# EasyEDA Pro project wave filter_test.eprj

# Schematic Schematic1
Create Date: 2023-06-25; Page Name: P1; Project Name: wave filter_test; Schematic Name: Schematic1; Update Date: 2023-07-01; Company: 嘉立创EDA; Page Size: A3; Version: V1.0
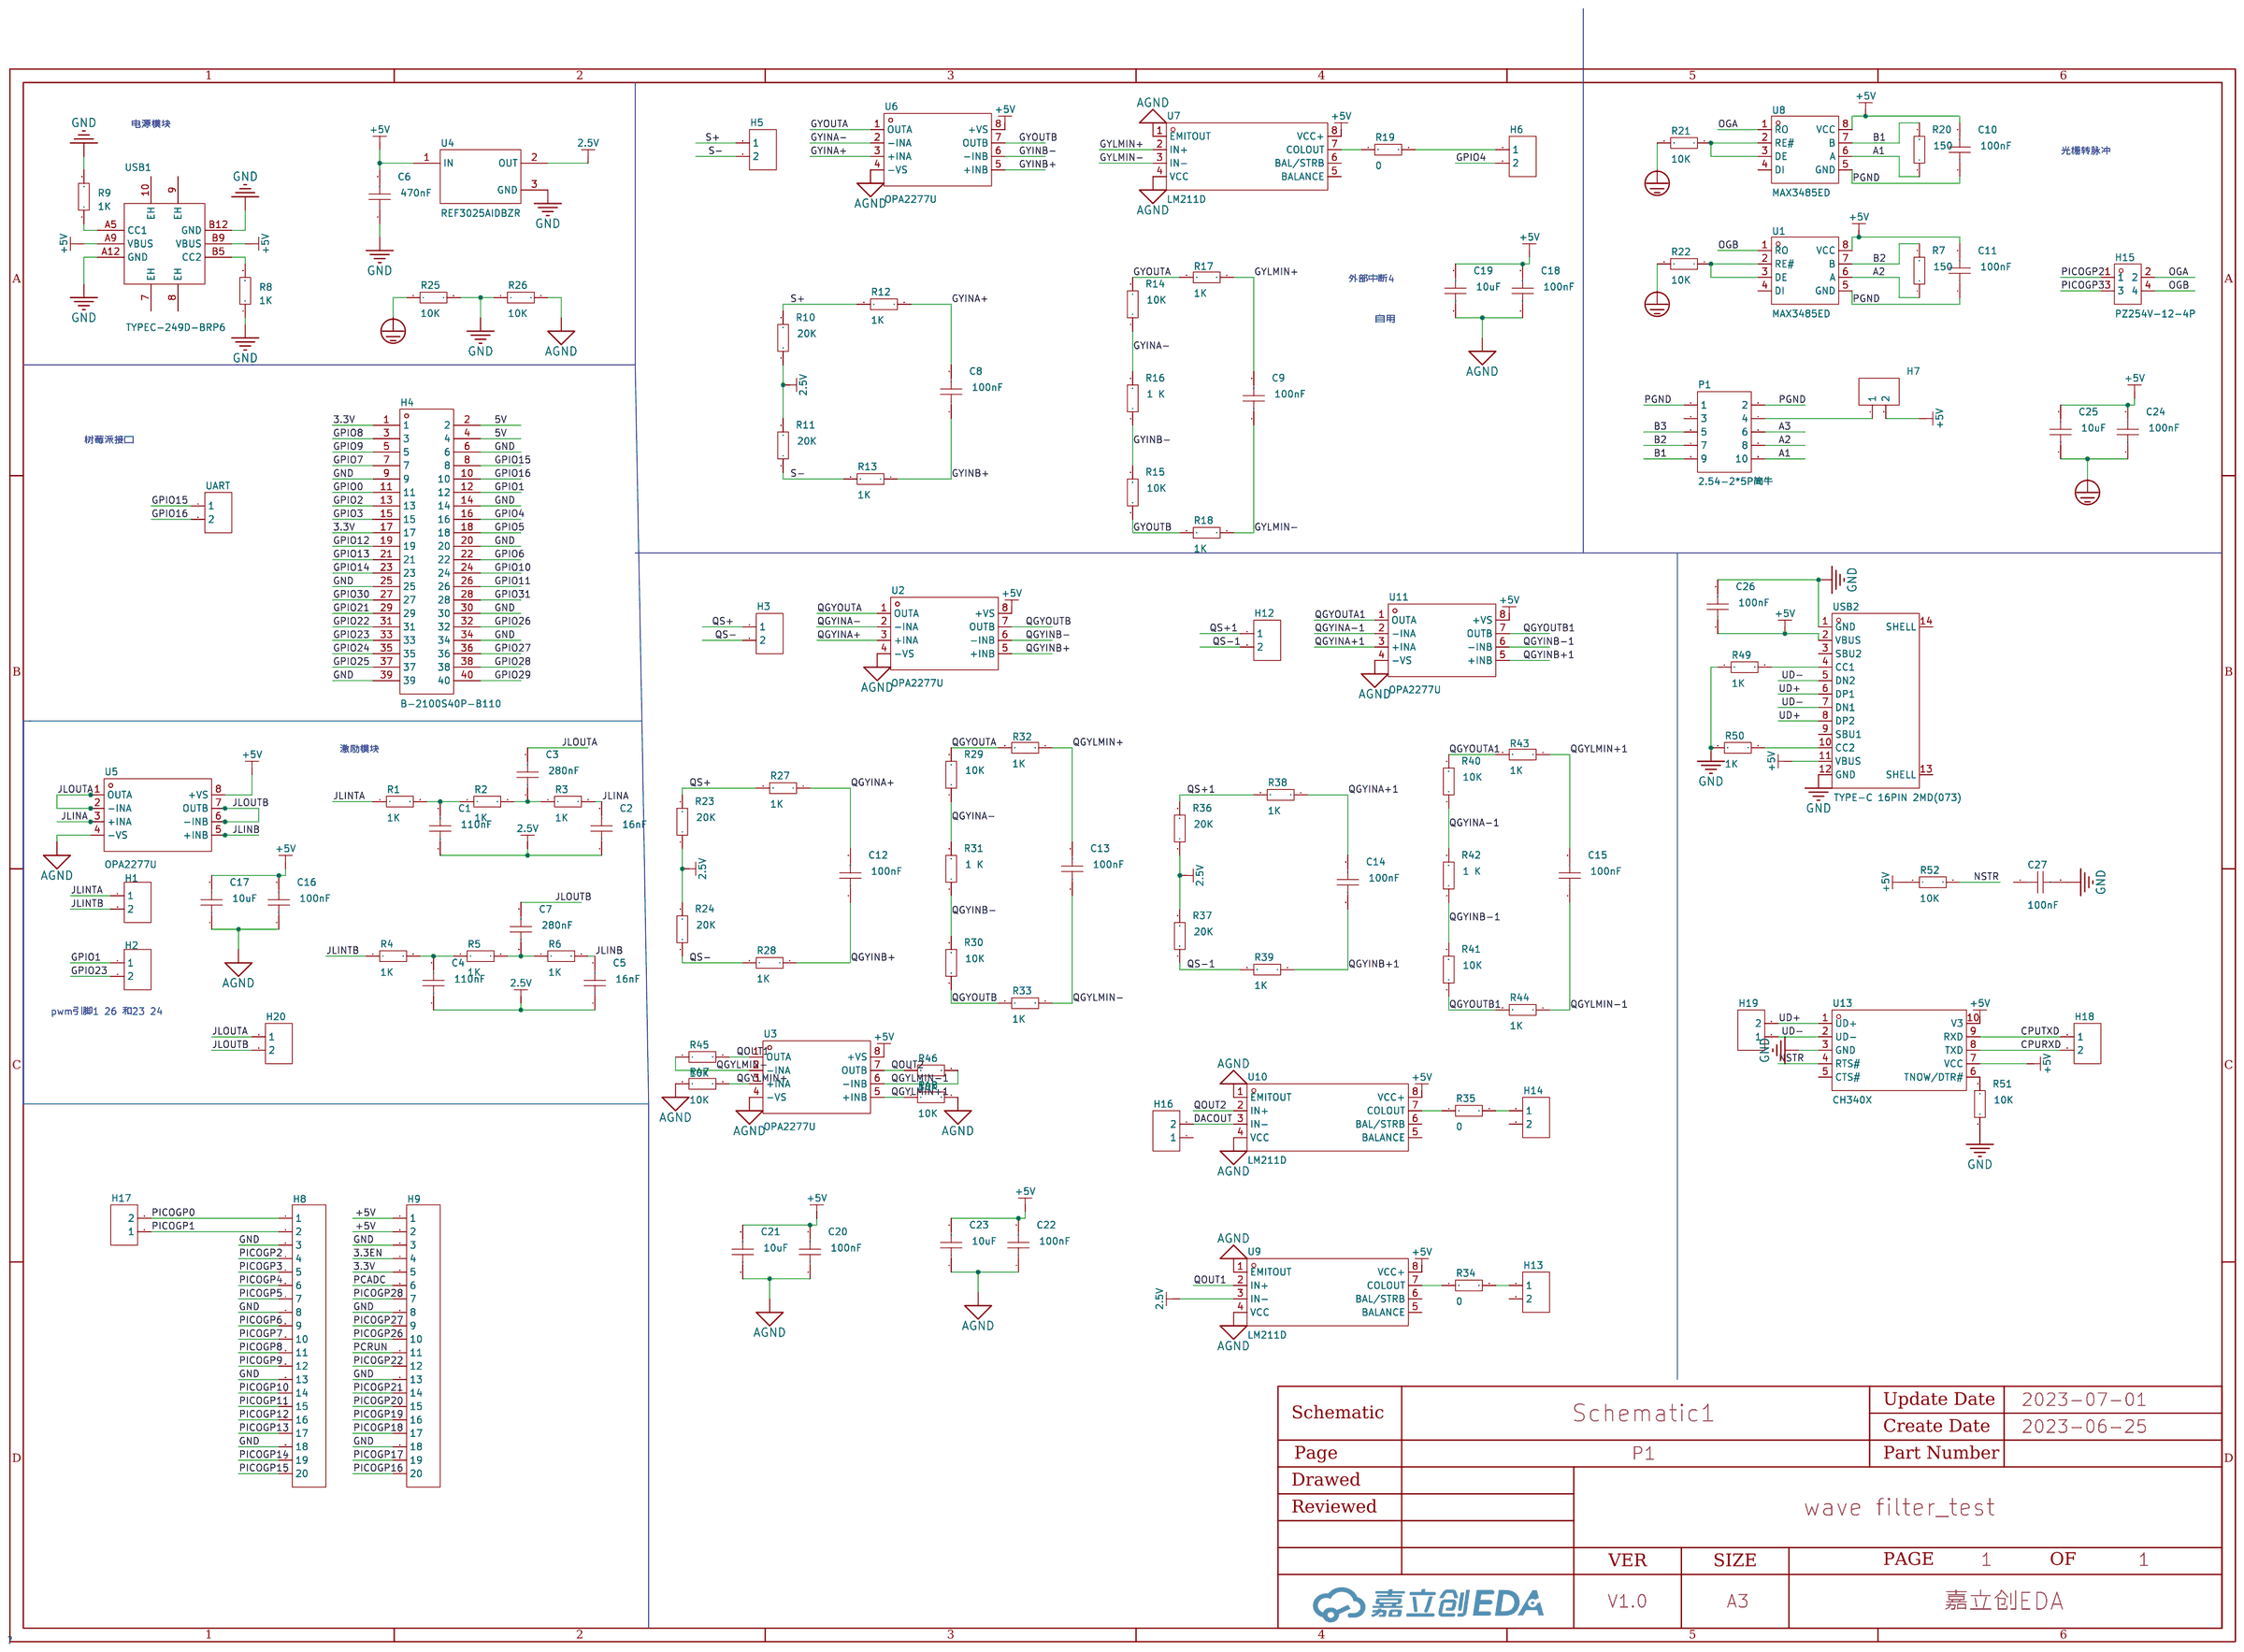
[diagram p0: schematic sheet]

## Parts
C1  110nF  [C0603]
C2  16nF  [C0603]
C3  280nF  [C0603]
C4  110nF  [C0603]
C5  16nF  [C0603]
C6  470nF  [C0603]
C7  280nF  [C0603]
C8  100nF  [C0603]
C9  100nF  [C0603]
C10  100nF  [C0603]
C11  100nF  [C0603]
C12  100nF  [C0603]
C13  100nF  [C0603]
C14  100nF  [C0603]
C15  100nF  [C0603]
C16  100nF  [C0603]
C17  10uF  [C1206]
C18  100nF  [C0603]
C19  10uF  [C1206]
C20  100nF  [C0603]
C21  10uF  [C1206]
C22  100nF  [C0603]
C23  10uF  [C1206]
C24  100nF  [C0603]
C25  10uF  [C1206]
C26  100nF  [C0603]
C27  100nF  [C0603]
H1  -  [HDR-TH_2P-P2.54-V-F]
H2  -  [HDR-TH_2P-P2.54-V-F]
H3  -  [HDR-TH_2P-P2.54-V-F]
H4  B-2100S40P-B110  [HDR-TH_40P-P2.54-V-M-R2-C20-S2.54]
H5  -  [HDR-TH_2P-P2.54-V-F]
H6  -  [HDR-TH_2P-P2.54-V-F]
H7  -  [HDR-TH_2P-P2.54-V-F]
H8  -  [HDR-TH_20P-P2.54-V-F]
H9  -  [HDR-TH_20P-P2.54-V-F]
H12  -  [HDR-TH_2P-P2.54-V-F]
H13  -  [HDR-TH_2P-P2.54-V-F]
H14  -  [HDR-TH_2P-P2.54-V-F]
H15  PZ254V-12-4P  [HDR-TH_4P-P2.54-V-M-R2-C2-S2.54]
H16  -  [HDR-TH_2P-P2.54-V-F]
H17  -  [HDR-TH_2P-P2.54-V-F]
H18  -  [HDR-TH_2P-P2.54-V-F]
H19  -  [HDR-TH_2P-P2.54-V-F]
H20  -  [HDR-TH_2P-P2.54-V-F]
P1  2.54-2*5P简牛  [IDC-TH_10P-P2.54_C5665]
R1  1K  [R0603]
R2  1K  [R0603]
R3  1K  [R0603]
R4  1K  [R0603]
R5  1K  [R0603]
R6  1K  [R0603]
R7  150  [R0603]
R8  1K  [R0603]
R9  1K  [R0603]
R10  20K  [R0603]
R11  20K  [R0603]
R12  1K  [R0603]
R13  1K  [R0603]
R14  10K  [R0603]
R15  10K  [R0603]
R16  1 K  [R0603]
R17  1K  [R0603]
R18  1K  [R0603]
R19  0  [R0603]
R20  150  [R0603]
R21  10K  [R0603]
R22  10K  [R0603]
R23  20K  [R0603]
R24  20K  [R0603]
R25  10K  [R0603]
R26  10K  [R0603]
R27  1K  [R0603]
R28  1K  [R0603]
R29  10K  [R0603]
R30  10K  [R0603]
R31  1 K  [R0603]
R32  1K  [R0603]
R33  1K  [R0603]
R34  0  [R0603]
R35  0  [R0603]
R36  20K  [R0603]
R37  20K  [R0603]
R38  1K  [R0603]
R39  1K  [R0603]
R40  10K  [R0603]
R41  10K  [R0603]
R42  1 K  [R0603]
R43  1K  [R0603]
R44  1K  [R0603]
R45  10K  [R0603]
R46  10K  [R0603]
R47  10K  [R0603]
R48  10K  [R0603]
R49  1K  [R0603]
R50  1K  [R0603]
R51  10K  [R0603]
R52  10K  [R0603]
U1  MAX3485ED  [SOP-8_L4.9-W3.9-P1.27-LS6.0-BL]
U2  OPA2277U  [SOIC-8_L4.9-W3.9-P1.27-LS6.0-BL]
U3  OPA2277U  [SOIC-8_L4.9-W3.9-P1.27-LS6.0-BL]
U4  REF3025AIDBZR  [SOT-23-3_L2.9-W1.6-P1.90-LS2.8-BR]
U5  OPA2277U  [SOIC-8_L4.9-W3.9-P1.27-LS6.0-BL]
U6  OPA2277U  [SOIC-8_L4.9-W3.9-P1.27-LS6.0-BL]
U7  LM211D  [SOIC-8_L4.9-W3.9-P1.27-LS6.0-BL]
U8  MAX3485ED  [SOP-8_L4.9-W3.9-P1.27-LS6.0-BL]
U9  LM211D  [SOIC-8_L4.9-W3.9-P1.27-LS6.0-BL]
U10  LM211D  [SOIC-8_L4.9-W3.9-P1.27-LS6.0-BL]
U11  OPA2277U  [SOIC-8_L4.9-W3.9-P1.27-LS6.0-BL]
U13  CH340X  [MSOP-10_L3.0-W3.0-P0.50-LS5.0-BL]
UART  -  [HDR-TH_2P-P2.54-V-F]
USB1  TYPEC-249D-BRP6  [USB-C-SMD_XUNPU_TYPEC-249D-BRP6]
USB2  TYPE-C 16PIN 2MD(073)  [USB-C-SMD_TYPE-C-6PIN-2MD-073]

## Library data of the parts
C1-C16 C18 C20 C22 C24 C27 = CAP_0603: Supplier Footprint: 0603
C17 C19 C21 C23 C25 C26 = CAP_1206: Supplier Footprint: 1206
H1-H3 H5-H7 H12-H14 H16-H20 UART = HDR-F_2.54_1x2P: Supplier Part: C49661; Supplier Footprint: 插件
H4 = B-2100S40P-B110: 排数:双排;总PIN位数:40;间距:2.54mm;插针结构:2x20P;行距:2.54mm;安装类型:直插;圆针/方针:-;额定电流:-;额定电压:-;配合针长度:6mm;塑高:2.54mm;端接针长度:3mm;触头材质:黄铜;触头镀层:-;工作温度范围:-40~+105;颜色:黑色;; LCSC Part Name: 2.54mm 2x20P 直插; Supplier Part: C124383; Manufacturer: Ckmtw(灿科盟); Supplier Footprint: 直插,P=2.54mm; JLCPCB Part Class: Extended Part; Datasheet: https://atta.szlcsc.com/upload/public/pdf/source/20170821/C124383_1503303310291901537.pdf; Supplier: LCSC; Number of Rows: 双排; Number of Pins: 40; Pitch: 2.54mm; Pin Structure: 2x20P; Row Spacing: 2.54mm; Mounting Type: 直插; Length of Mating Pin: 6mm; Insulation Height: 2.54mm; Length of End Connection Pin: 3mm; Contact Material: 黄铜; Operating Temperature Range: -40~+105; Color: 黑色
H8 H9 = HDR-F_2.54_1x20P: Supplier Part: C50984; Supplier Footprint: 插件
H15 = PZ254V-12-4P: 排数:双排;总PIN位数:4;间距:2.54mm;插针结构:2x2P;行距:2.54mm;安装类型:直插;圆针/方针:方针;额定电流:-;额定电压:-;配合针长度:6mm;塑高:2.5mm;端接针长度:3mm;触头材质:黄铜;触头镀层:-;工作温度范围:-40~+105;颜色:黑色;; LCSC Part Name: 2.54mm 2x2P 直插 方针; Supplier Part: C492419; Manufacturer: XFCN(兴飞); Supplier Footprint: 直插,P=2.54mm; JLCPCB Part Class: Extended Part; Datasheet: https://atta.szlcsc.com/upload/public/pdf/source/20200309/C492419_0001C06E73AFF21BD0ED3D7CEEF46D29.pdf; Supplier: LCSC; Number of Rows: 双排; Number of Pins: 4; Pitch: 2.54mm; Pin Structure: 2x2P; Row Spacing: 2.54mm; Mounting Type: 直插; Circluar Pins/Square Pins: 方针; Length of Mating Pin: 6mm; Insulation Height: 2.5mm; Length of End Connection Pin: 3mm; Contact Material: 黄铜; Operating Temperature Range: -40~+105; Color: 黑色
P1 = 2.54-2*5P简牛: 连接器类型:简牛座;每排PIN数:5;排数:2;间距:2.54mm;行距:2.54mm;封装形式:直插;触头材质:-;触头镀层:-;; LCSC Part Name: 每排P数:5 排数:2 2.54mm; Supplier Part: C5665; Manufacturer: BOOMELE(博穆精密); Supplier Footprint: 插件,P=2.54mm; JLCPCB Part Class: Extended Part; Datasheet: https://atta.szlcsc.com/upload/public/pdf/source/20140331/1457707037896.pdf; Supplier: LCSC; Connector Type: 简牛座; Pin Number in each Row: 5; Number of Rows: 2; Pitch: 2.54mm; Row Spacing: 2.54mm; Holder Type: 直插
R1-R52 = Res_0603: Supplier Footprint: 0603
U1 U8 = MAX3485ED: 类型:-;协议类别:-;驱动器/接收器数:-;数据速率:-;; Supplier Part: C558792; Manufacturer: HTC; Supplier Footprint: SOP-8; JLCPCB Part Class: Extended Part; Datasheet: https://atta.szlcsc.com/upload/public/pdf/source/20200522/C558792_9E3A5168BF220BB2C20A3F3D0A7BA0BA.pdf; Supplier: LCSC
U2 U3 U5 U6 U11 = OPA2277U: 运放类型:General Purpose;放大器组数:2;增益带宽积（GBP）:1MHz;压摆率（SR）:0.8 V/us;电源电压:4V~36V,±2V~18V;各通道供电电流:790A;; Supplier Part: C24668; Manufacturer: TI(德州仪器); Supplier Footprint: SOIC-8_150mil; JLCPCB Part Class: Extended Part; Datasheet: https://atta.szlcsc.com/upload/public/pdf/source/20131226/1457706668027.pdf; Supplier: LCSC; Amplifier Type: General Purpose; Number of Circuits: 2; Gain Bandwidth Product（GBP）: 1MHz; Slew Rate（SR）: 0.8 V/us; Supply Voltage（Single）: 4V~36V,±2V~18V; Iq per channel (Typ): 790A
U4 = REF3025AIDBZR: 输出类型:固定;输入电压:2.55V~5.5V;输出电流:25mA;精度:±0.2%;; LCSC Part Name: 串联 25mA; Supplier Part: C11334; Manufacturer: TI(德州仪器); Supplier Footprint: SOT-23; JLCPCB Part Class: Extended Part; Datasheet: https://atta.szlcsc.com/upload/public/pdf/source/20130225/1457706593773.pdf; Supplier: LCSC; Reference Type: 串联; Output Type: 固定; Input Voltage: 2.55V~5.5V; Output Current: 25mA; Tolerance: ±0.2%; Temperature Coefficient: 75ppm/; Supply Current: 50uA; Noise - 1/10Hz to 10Hz: 28uVp-p; Noise - 10Hz to 10kHz: 80uVrms; Operating Temperature: -40~+125@(Ta)
U7 U9 U10 = LM211D_C2969760: Supplier Part: C2969760; Manufacturer: ST(意法半导体); Supplier Footprint: SO-8; Supplier: LCSC
U13 = CH340X: Supplier Part: C3035748; Manufacturer: WCH(南京沁恒); Supplier Footprint: MSOP-10; JLCPCB Part Class: Extended Part; Supplier: LCSC
USB1 = TYPEC-249D-BRP6: 连接器类型:Type-C;标准:USB 3.1;公母:母座;触点数量:6;端口数量:1;安装方式:卧贴;额定电流 - 电源:3A;工作温度范围:-25~+85;焊接温度(最大值):260;; LCSC Part Name: Type-C 母座 卧贴; Supplier Part: C2895023; Manufacturer: XUNPU(讯普); Supplier Footprint: SMD,8.94x6.80x3.16mm; JLCPCB Part Class: Extended Part; Datasheet: https://atta.szlcsc.com/upload/public/pdf/source/20210908/4D6B72D84B2C302C16FE09923A03B18C.pdf; Supplier: LCSC; Connector Type: Type-C; Standard: USB 3.1; Gender: 母座; Number of Contacts: 6; Number of Ports: 1; Mounting Style: 卧贴; Current Rating - Power (Max): 3A; Operating Temperature Range: -25~+85; Welding Temperature (Max): 260
USB2 = TYPE-C 16PIN 2MD(073): 连接器类型:Type-C;标准:-;公母:母座;触点数量:16;端口数量:1;安装方式:卧贴;额定电流 - 电源:5A;工作温度范围:-25~+85;; LCSC Part Name: TYPE-C母座 16P 4脚插件带定位柱 不锈钢外壳 2次模顶; Supplier Part: C2765186; Manufacturer: SHOU HAN(首韩); Supplier Footprint: SMD; JLCPCB Part Class: Extended Part; Datasheet: https://atta.szlcsc.com/upload/public/pdf/source/20211123/39B17C16241EAC15C5E277BDA434118E.pdf; Supplier: LCSC; Connector Type: Type-C; Gender: 母座; Number of Contacts: 16; Number of Ports: 1; Mounting Style: 卧贴; Current Rating - Power (Max): 5A; Operating Temperature Range: -25~+85

## Nets
2.5V: C1.1 C2.1 C4.1 C5.1 R10.1 R11.2 R23.1 R24.2 R36.1 R37.2 U4.2(OUT) U9.3(IN-)
3.3V: H4.1 H4.17 H9.5
5V: H4.2 H4.4
+5V: C6.2 C10.2 C11.2 C16.2 C17.2 C18.2 C19.2 C20.2 C21.2 C22.2 C23.2 C24.2 C25.2 C26.1 H7.2 H9.1 H9.2 R52.1 U1.8(VCC) U2.8(+VS) U3.8(+VS) U4.1(IN) U5.8(+VS) U6.8(+VS) U7.8(VCC+) U8.8(VCC) U9.8(VCC+) U10.8(VCC+) U11.8(+VS) U13.7(VCC) U13.10(V3) USB1.A9(VBUS) USB1.B9(VBUS) USB2.2(VBUS) USB2.11(VBUS)
AGND: C16.1 C17.1 C18.1 C19.1 C20.1 C21.1 C22.1 C23.1 R26.2 R47.1 R48.2 U2.4(-VS) U3.4(-VS) U5.4(-VS) U6.4(-VS) U7.1(EMITOUT) U7.4(VCC) U9.1(EMITOUT) U9.4(VCC) U10.1(EMITOUT) U10.4(VCC) U11.4(-VS)
GND: C6.1 C26.2 C27.2 H4.6 H4.9 H4.14 H4.20 H4.25 H4.30 H4.34 H4.39 H8.3 H8.8 H8.13 H8.18 H9.3 H9.8 H9.13 H9.18 R8.1 R9.2 R25.2 R26.1 R49.1 R50.1 R51.1 U4.3(GND) U13.3(GND) USB1.A12(GND) USB1.B12(GND) USB2.1(GND) USB2.12(GND)
PGND: C10.1 C11.1 C24.1 C25.1 P1.1 P1.2 R21.2 R22.2 R25.1 U1.5(GND) U8.5(GND)
3.3EN: H9.4
A1: P1.10 R20.1 U8.6(A)
A2: P1.8 R7.1 U1.6(A)
A3: P1.6
B1: P1.9 R20.2 U8.7(B)
B2: P1.7 R7.2 U1.7(B)
B3: P1.5
CPURXD: H18.2 U13.8(TXD)
CPUTXD: H18.1 U13.9(RXD)
DACOUT: H16.2 U10.3(IN-)
GPIO0: H4.11
GPIO1: H2.1 H4.12
GPIO2: H4.13
GPIO3: H4.15
GPIO4: H4.16 H6.2
GPIO5: H4.18
GPIO6: H4.22
GPIO7: H4.7
GPIO8: H4.3
GPIO9: H4.5
GPIO10: H4.24
GPIO11: H4.26
GPIO12: H4.19
GPIO13: H4.21
GPIO14: H4.23
GPIO15: H4.8 UART.1
GPIO16: H4.10 UART.2
GPIO21: H4.29
GPIO22: H4.31
GPIO23: H2.2 H4.33
GPIO24: H4.35
GPIO25: H4.37
GPIO26: H4.32
GPIO27: H4.36
GPIO28: H4.38
GPIO29: H4.40
GPIO30: H4.27
GPIO31: H4.28
GYINA+: C8.2 R12.1 U6.3(+INA)
GYINA-: R14.1 R16.2 U6.2(-INA)
GYINB+: C8.1 R13.1 U6.5(+INB)
GYINB-: R15.2 R16.1 U6.6(-INB)
GYLMIN+: C9.2 R17.1 U7.2(IN+)
GYLMIN-: C9.1 R18.1 U7.3(IN-)
GYOUTA: R14.2 R17.2 U6.1(OUTA)
GYOUTB: R15.1 R18.2 U6.7(OUTB)
JLINA: C2.2 R3.2 U5.3(+INA)
JLINB: C5.2 R6.2 U5.5(+INB)
JLINTA: H1.1 R1.1
JLINTB: H1.2 R4.1
JLOUTA: C3.2 H20.1 U5.1(OUTA) U5.2(-INA)
JLOUTB: C7.2 H20.2 U5.6(-INB) U5.7(OUTB)
NSTR: R52.2 U13.4(RTS#)
OGA: H15.2 U8.1(RO)
OGB: H15.4 U1.1(RO)
PCADC: H9.6
PCRUN: H9.11
PICOGP0: H8.1 H17.2
PICOGP1: H8.2 H17.1
PICOGP2: H8.4 H15.1
PICOGP3: H8.5 H15.3
PICOGP4: H8.6
PICOGP5: H8.7
PICOGP6: H8.9
PICOGP7: H8.10
PICOGP8: H8.11
PICOGP9: H8.12
PICOGP10: H8.14
PICOGP11: H8.15
PICOGP12: H8.16
PICOGP13: H8.17
PICOGP14: H8.19
PICOGP15: H8.20
PICOGP16: H9.20
PICOGP17: H9.19
PICOGP18: H9.17
PICOGP19: H9.16
PICOGP20: H9.15
PICOGP21: H9.14
PICOGP22: H9.12
PICOGP26: H9.10
PICOGP27: H9.9
PICOGP28: H9.7
QGYINA+: C12.2 R27.1 U2.3(+INA)
QGYINA+1: C14.2 R38.1 U11.3(+INA)
QGYINA-: R29.1 R31.2 U2.2(-INA)
QGYINA-1: R40.1 R42.2 U11.2(-INA)
QGYINB+: C12.1 R28.1 U2.5(+INB)
QGYINB+1: C14.1 R39.1 U11.5(+INB)
QGYINB-: R30.2 R31.1 U2.6(-INB)
QGYINB-1: R41.2 R42.1 U11.6(-INB)
QGYLMIN+: C13.2 R32.1 R47.2 U3.3(+INA)
QGYLMIN+1: C15.2 R43.1 R48.1 U3.5(+INB)
QGYLMIN-: C13.1 R33.1 R45.1 U3.2(-INA)
QGYLMIN-1: C15.1 R44.1 R46.2 U3.6(-INB)
QGYOUTA: R29.2 R32.2 U2.1(OUTA)
QGYOUTA1: R40.2 R43.2 U11.1(OUTA)
QGYOUTB: R30.1 R33.2 U2.7(OUTB)
QGYOUTB1: R41.1 R44.2 U11.7(OUTB)
QOUT1: R45.2 U3.1(OUTA) U9.2(IN+)
QOUT2: R46.1 U3.7(OUTB) U10.2(IN+)
QS+: H3.1 R23.2 R27.2
QS+1: H12.1 R36.2 R38.2
QS-: H3.2 R24.1 R28.2
QS-1: H12.2 R37.1 R39.2
S+: H5.1 R10.2 R12.2
S-: H5.2 R11.1 R13.2
UD+: H19.2 U13.1(UD+) USB2.6(DP1) USB2.8(DP2)
UD-: H19.1 U13.2(UD-) USB2.5(DN2) USB2.7(DN1)
$1N3368: C1.2 R1.2 R2.1
$1N3416: C3.1 R2.2 R3.1
$1N13568: C4.2 R4.2 R5.1
$1N13571: C7.1 R5.2 R6.1
$1N16982: R19.1 U7.7(COLOUT)
$1N17068: H6.1 R19.2
$1N26460: R21.1 U8.2(RE#) U8.3(DE)
$1N26465: R22.1 U1.2(RE#) U1.3(DE)
$1N26481: H7.1 P1.4
$1N28900: R34.1 U9.7(COLOUT)
$1N28970: H13.1 R34.2
$1N29245: R35.1 U10.7(COLOUT)
$1N29246: H14.1 R35.2
$1N34544: R49.2 USB2.4(CC1)
$1N34597: R50.2 USB2.10(CC2)
$1N41821: R51.2 U13.6(TNOW/DTR#)
Net-(R8-2): R8.2 USB1.B5(CC2)
Net-(R9-1): R9.1 USB1.A5(CC1)

Not connected (* = marked no-connect by the designer): C27 1; H13 2; H14 2; H16 1; P1 3; U1 4(DI); U7 5(BALANCE) 6(BAL/STRB); U8 4(DI); U9 5(BALANCE) 6(BAL/STRB); U10 5(BALANCE) 6(BAL/STRB); U13 5(CTS#); USB1 7(EH) 8(EH) 9(EH) 10(EH); USB2 3(SBU2) 9(SBU1) 13(SHELL) 14(SHELL)

## Notes on the sheet
- 电源模块
- 光栅转脉冲
- 外部中断4
- 自用
- 树莓派接口
- 激励模块
- pwm引脚1 26 和23 24

# Schematic Schematic2
Create Date: 2023-06-29; Page Name: P1; Project Name: wave filter_test; Schematic Name: Schematic2; Update Date: 2023-06-29; Company: 嘉立创EDA; Page Size: A4; Version: V1.0
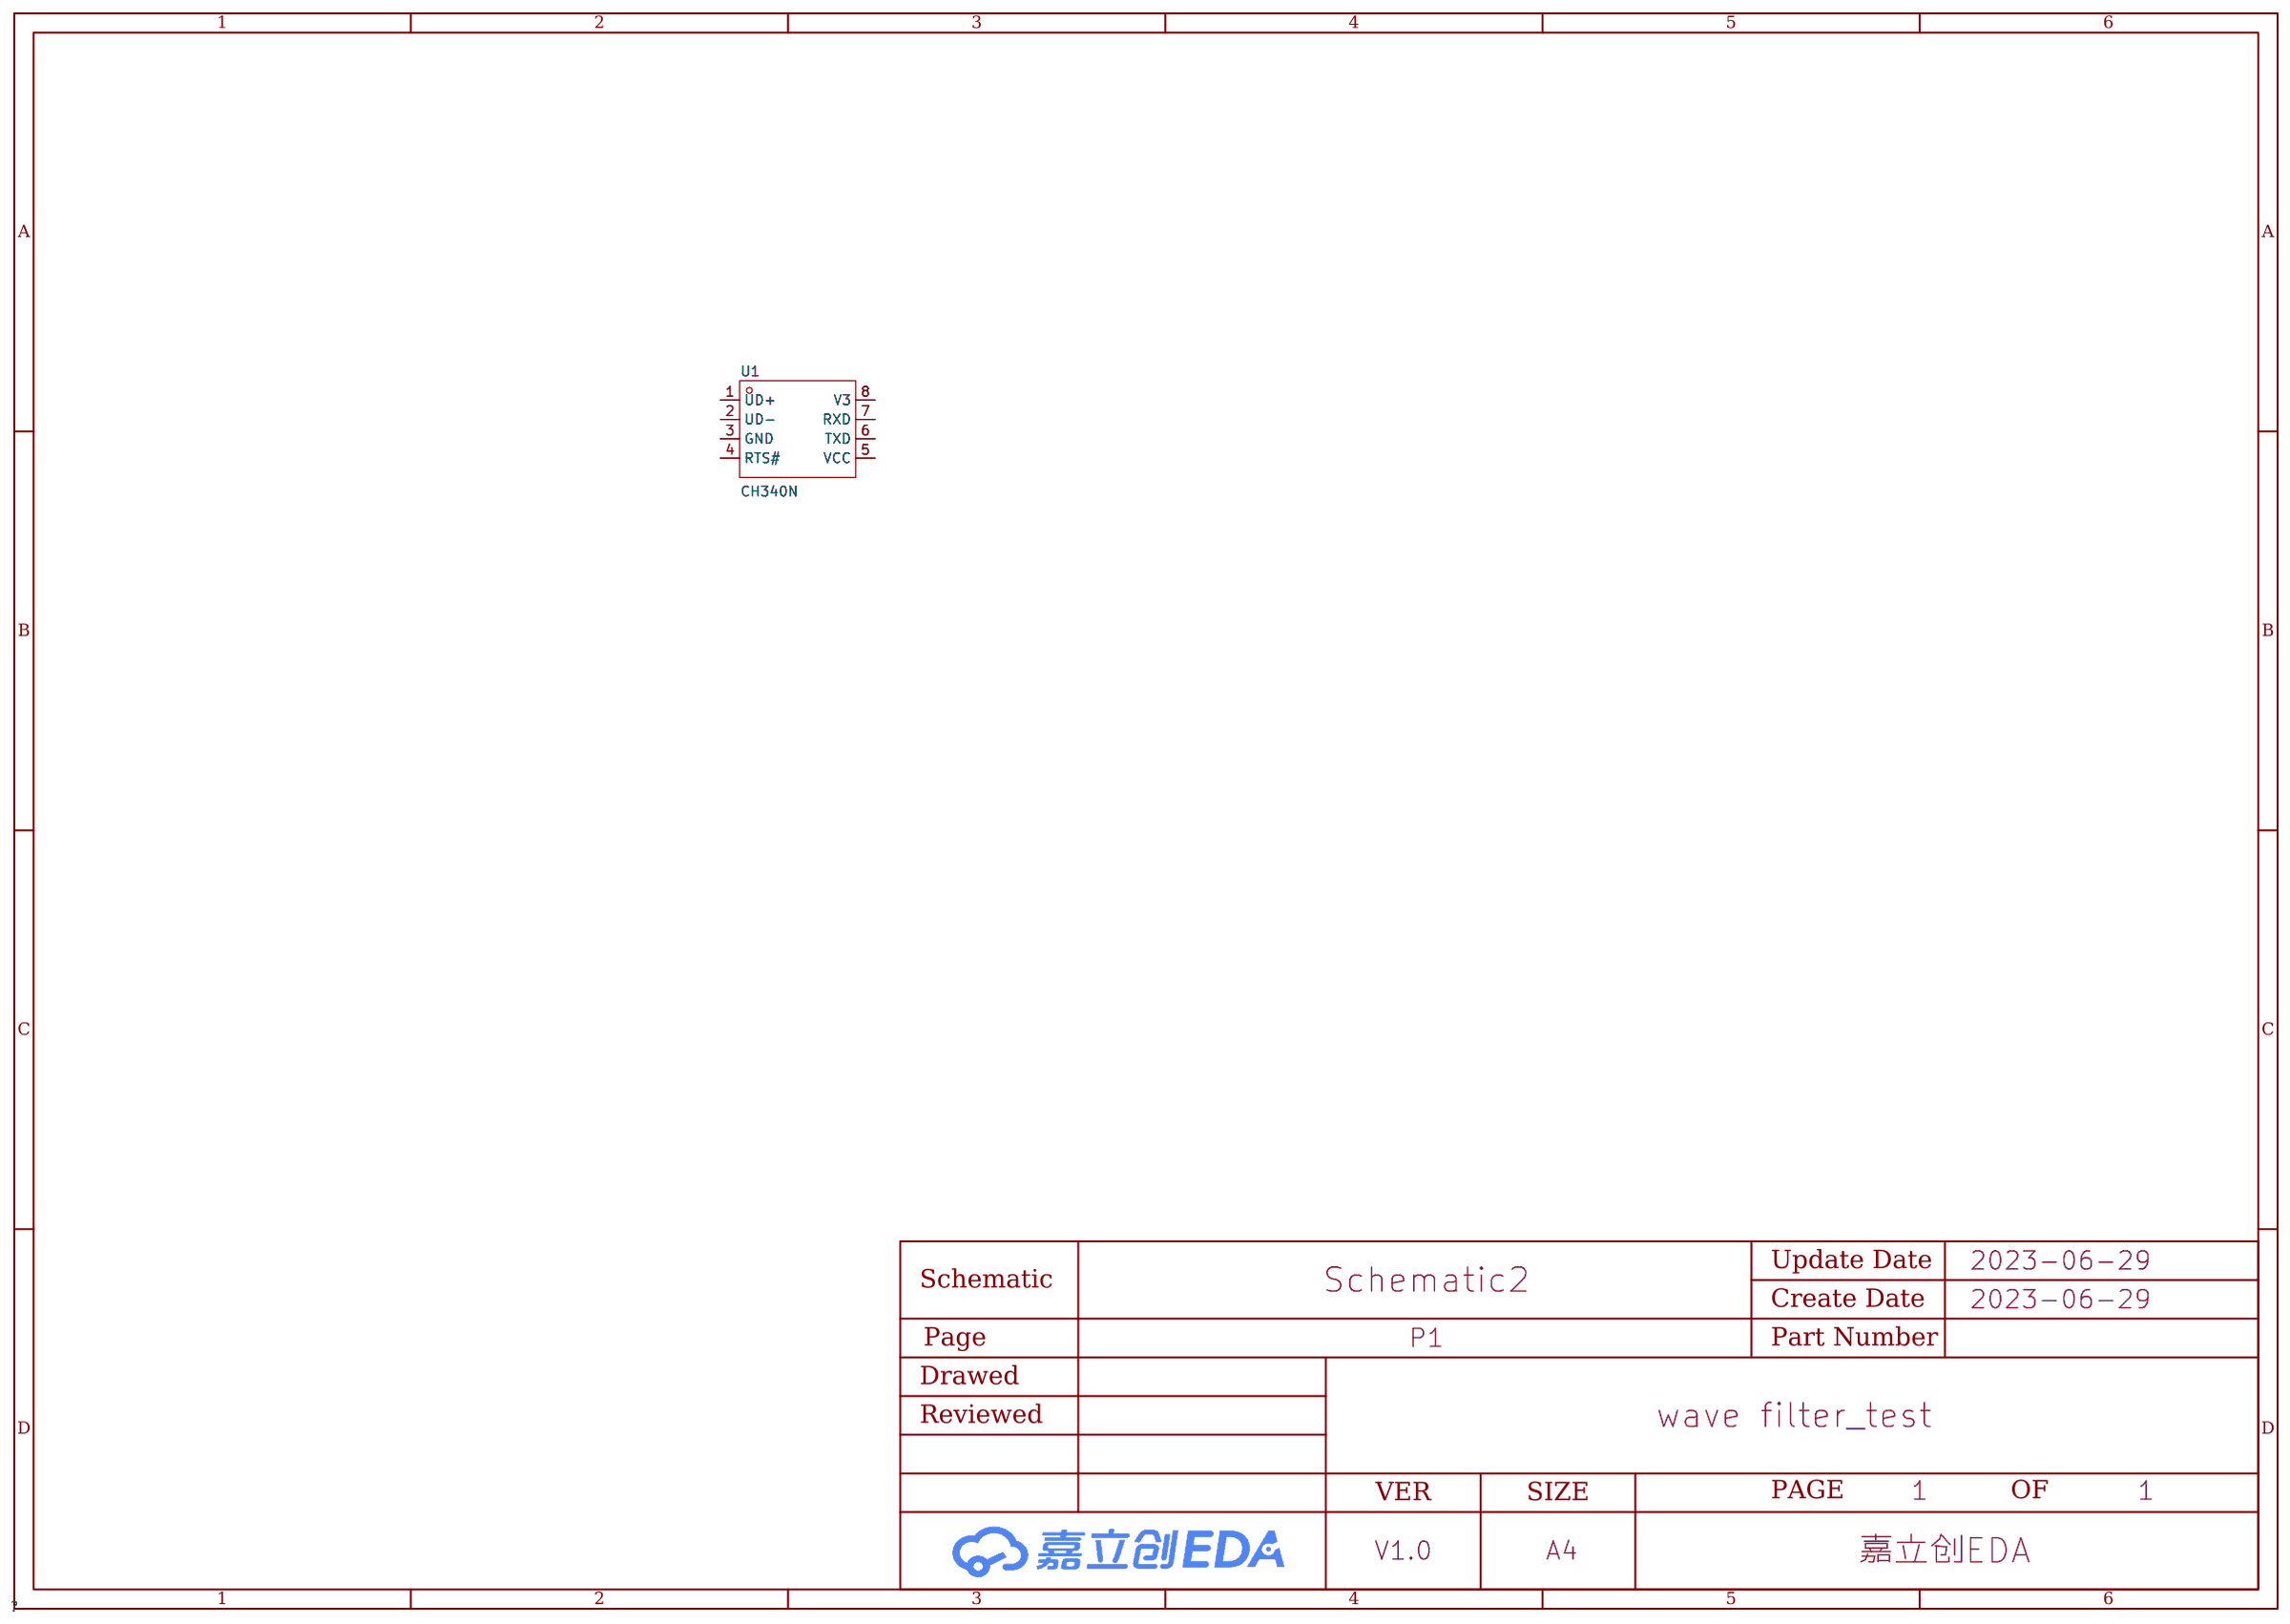
[diagram p1: schematic sheet]

## Parts
U1  CH340N  [SOP-8_L4.9-W3.9-P1.27-LS6.0-BL]

## Library data of the parts
U1 = CH340N: LCSC Part Name: USB转串口芯片 CH340; Supplier Part: C2977777; Manufacturer: WCH(南京沁恒); Supplier Footprint: SOP-8; JLCPCB Part Class: Extended Part; Datasheet: https://atta.szlcsc.com/upload/public/pdf/source/20220223/82A45E4FF89B3EDCAD50B354450A7EF4.pdf; Supplier: LCSC

## Nets

Not connected (* = marked no-connect by the designer): U1 1(UD+) 2(UD-) 3(GND) 4(RTS#) 5(VCC) 6(TXD) 7(RXD) 8(V3)

# Board PCB1
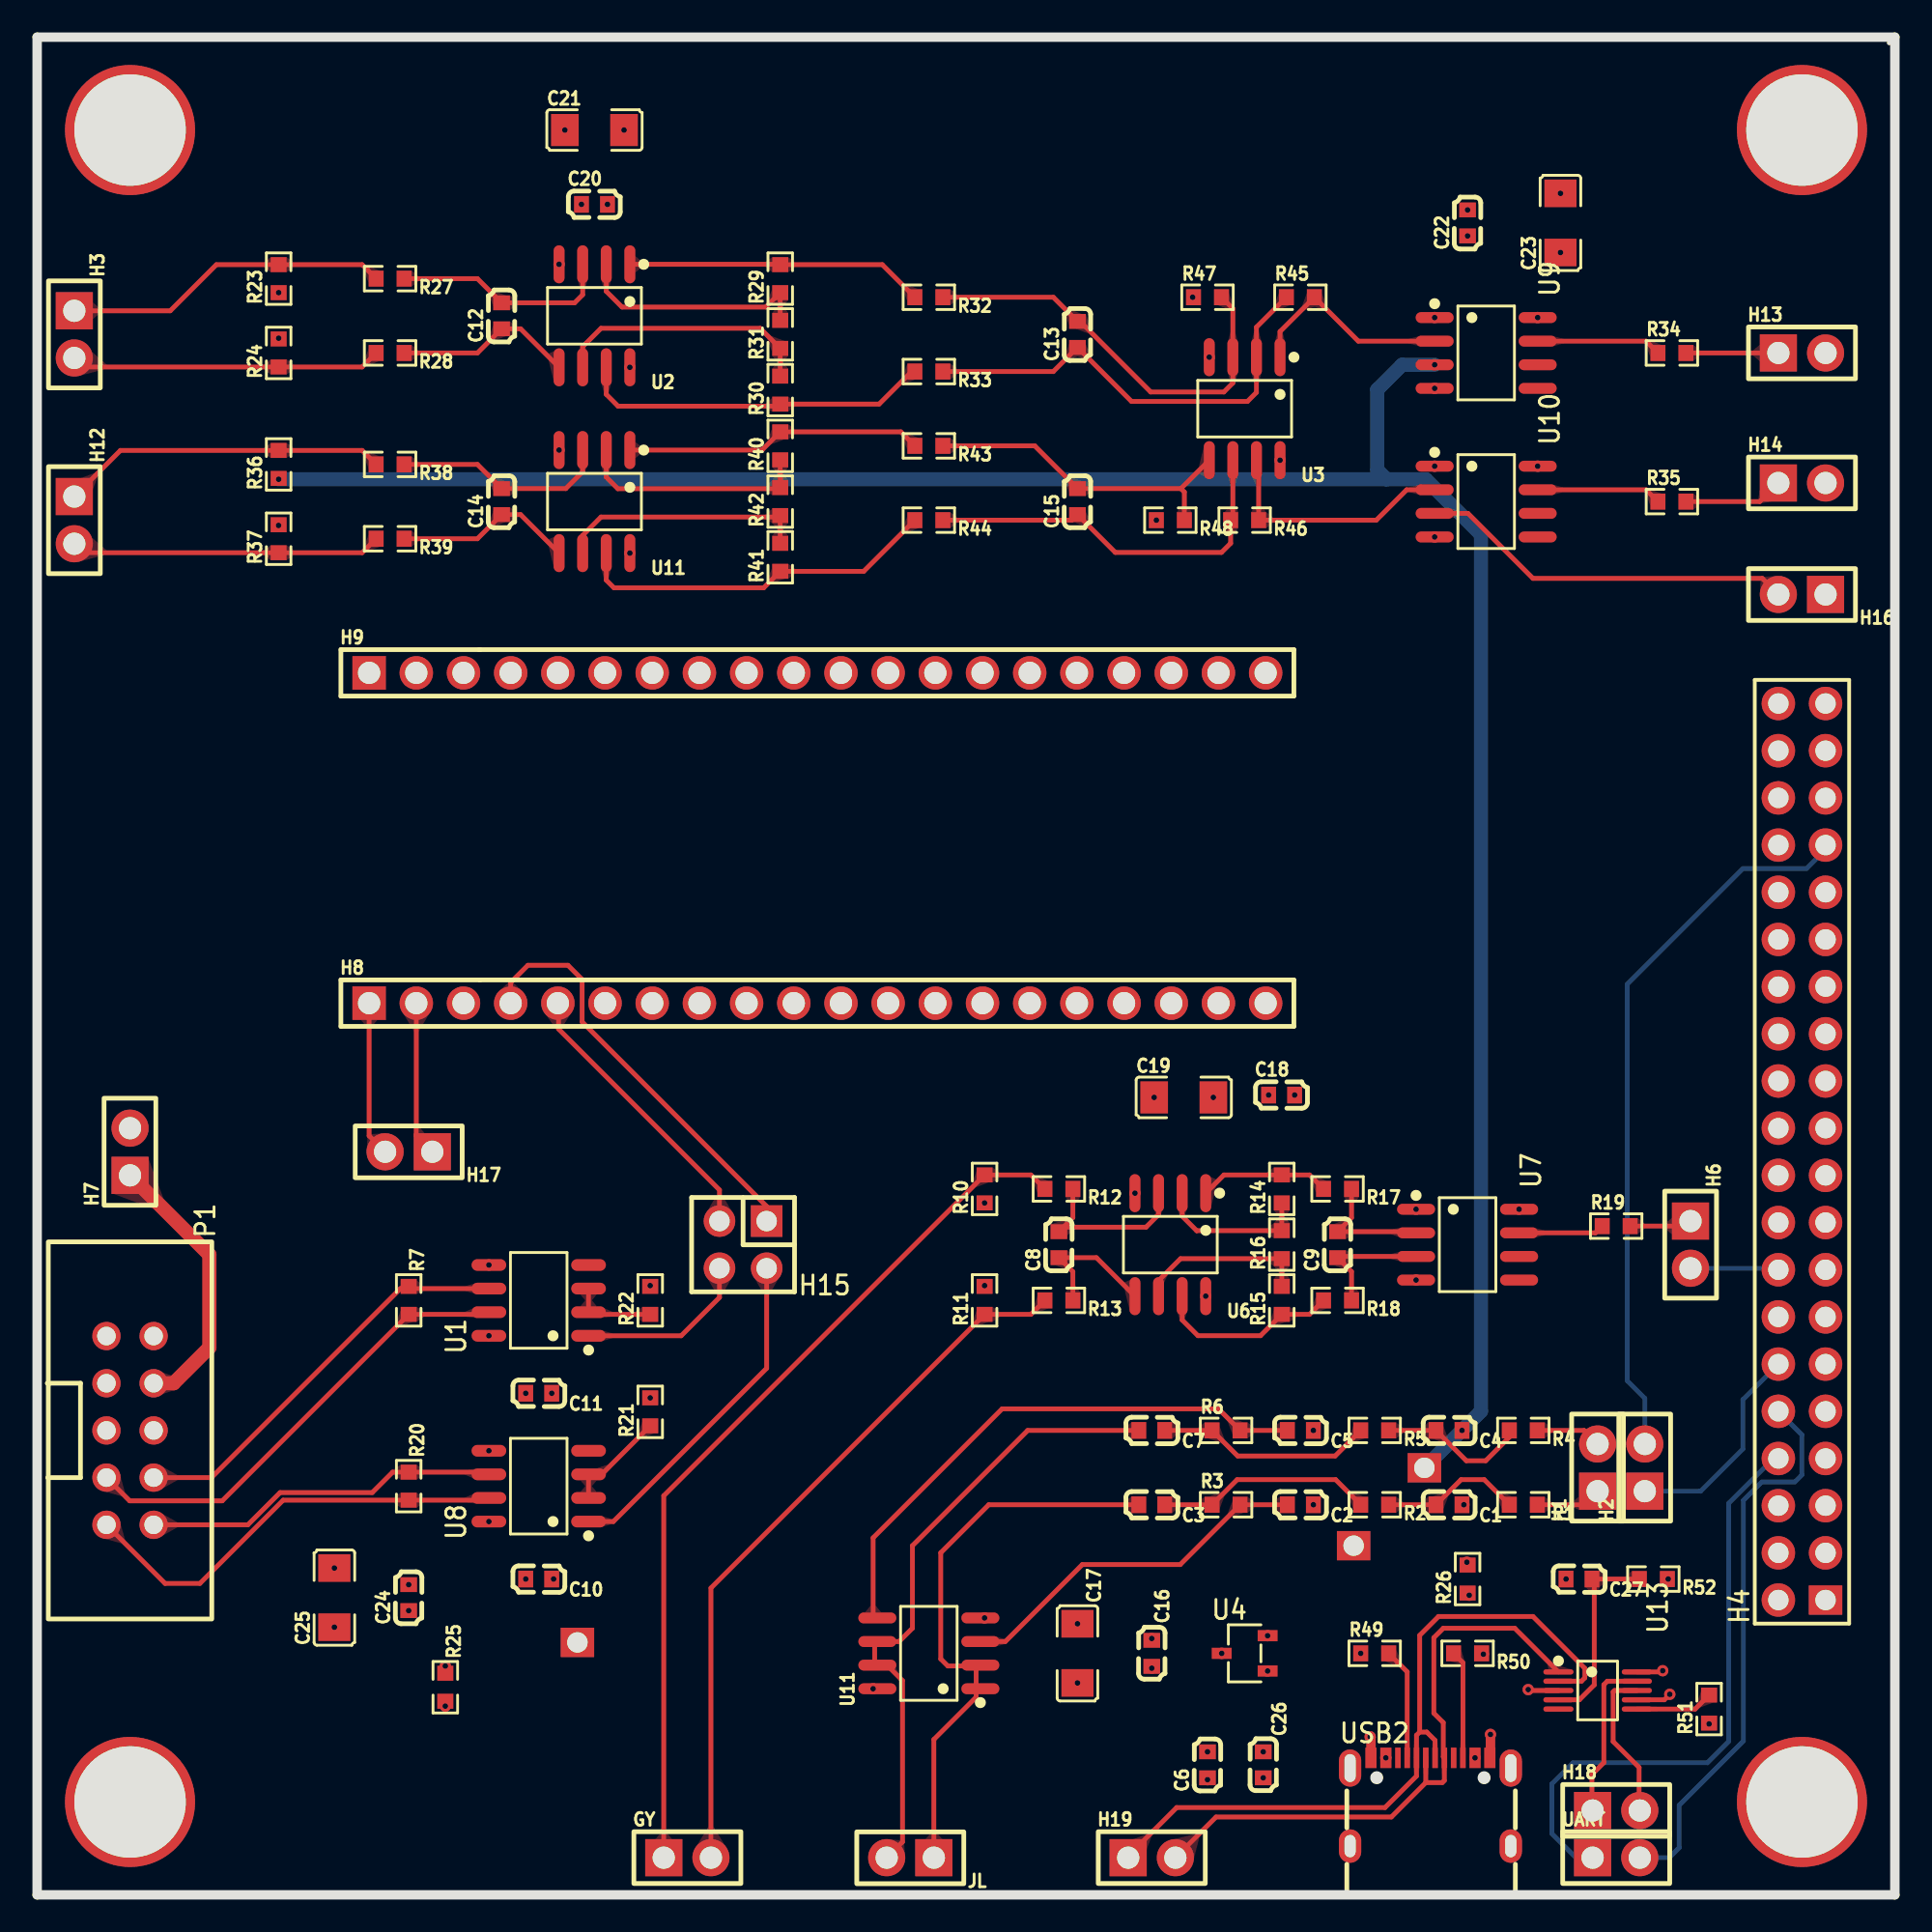
[diagram p2: board, top side]
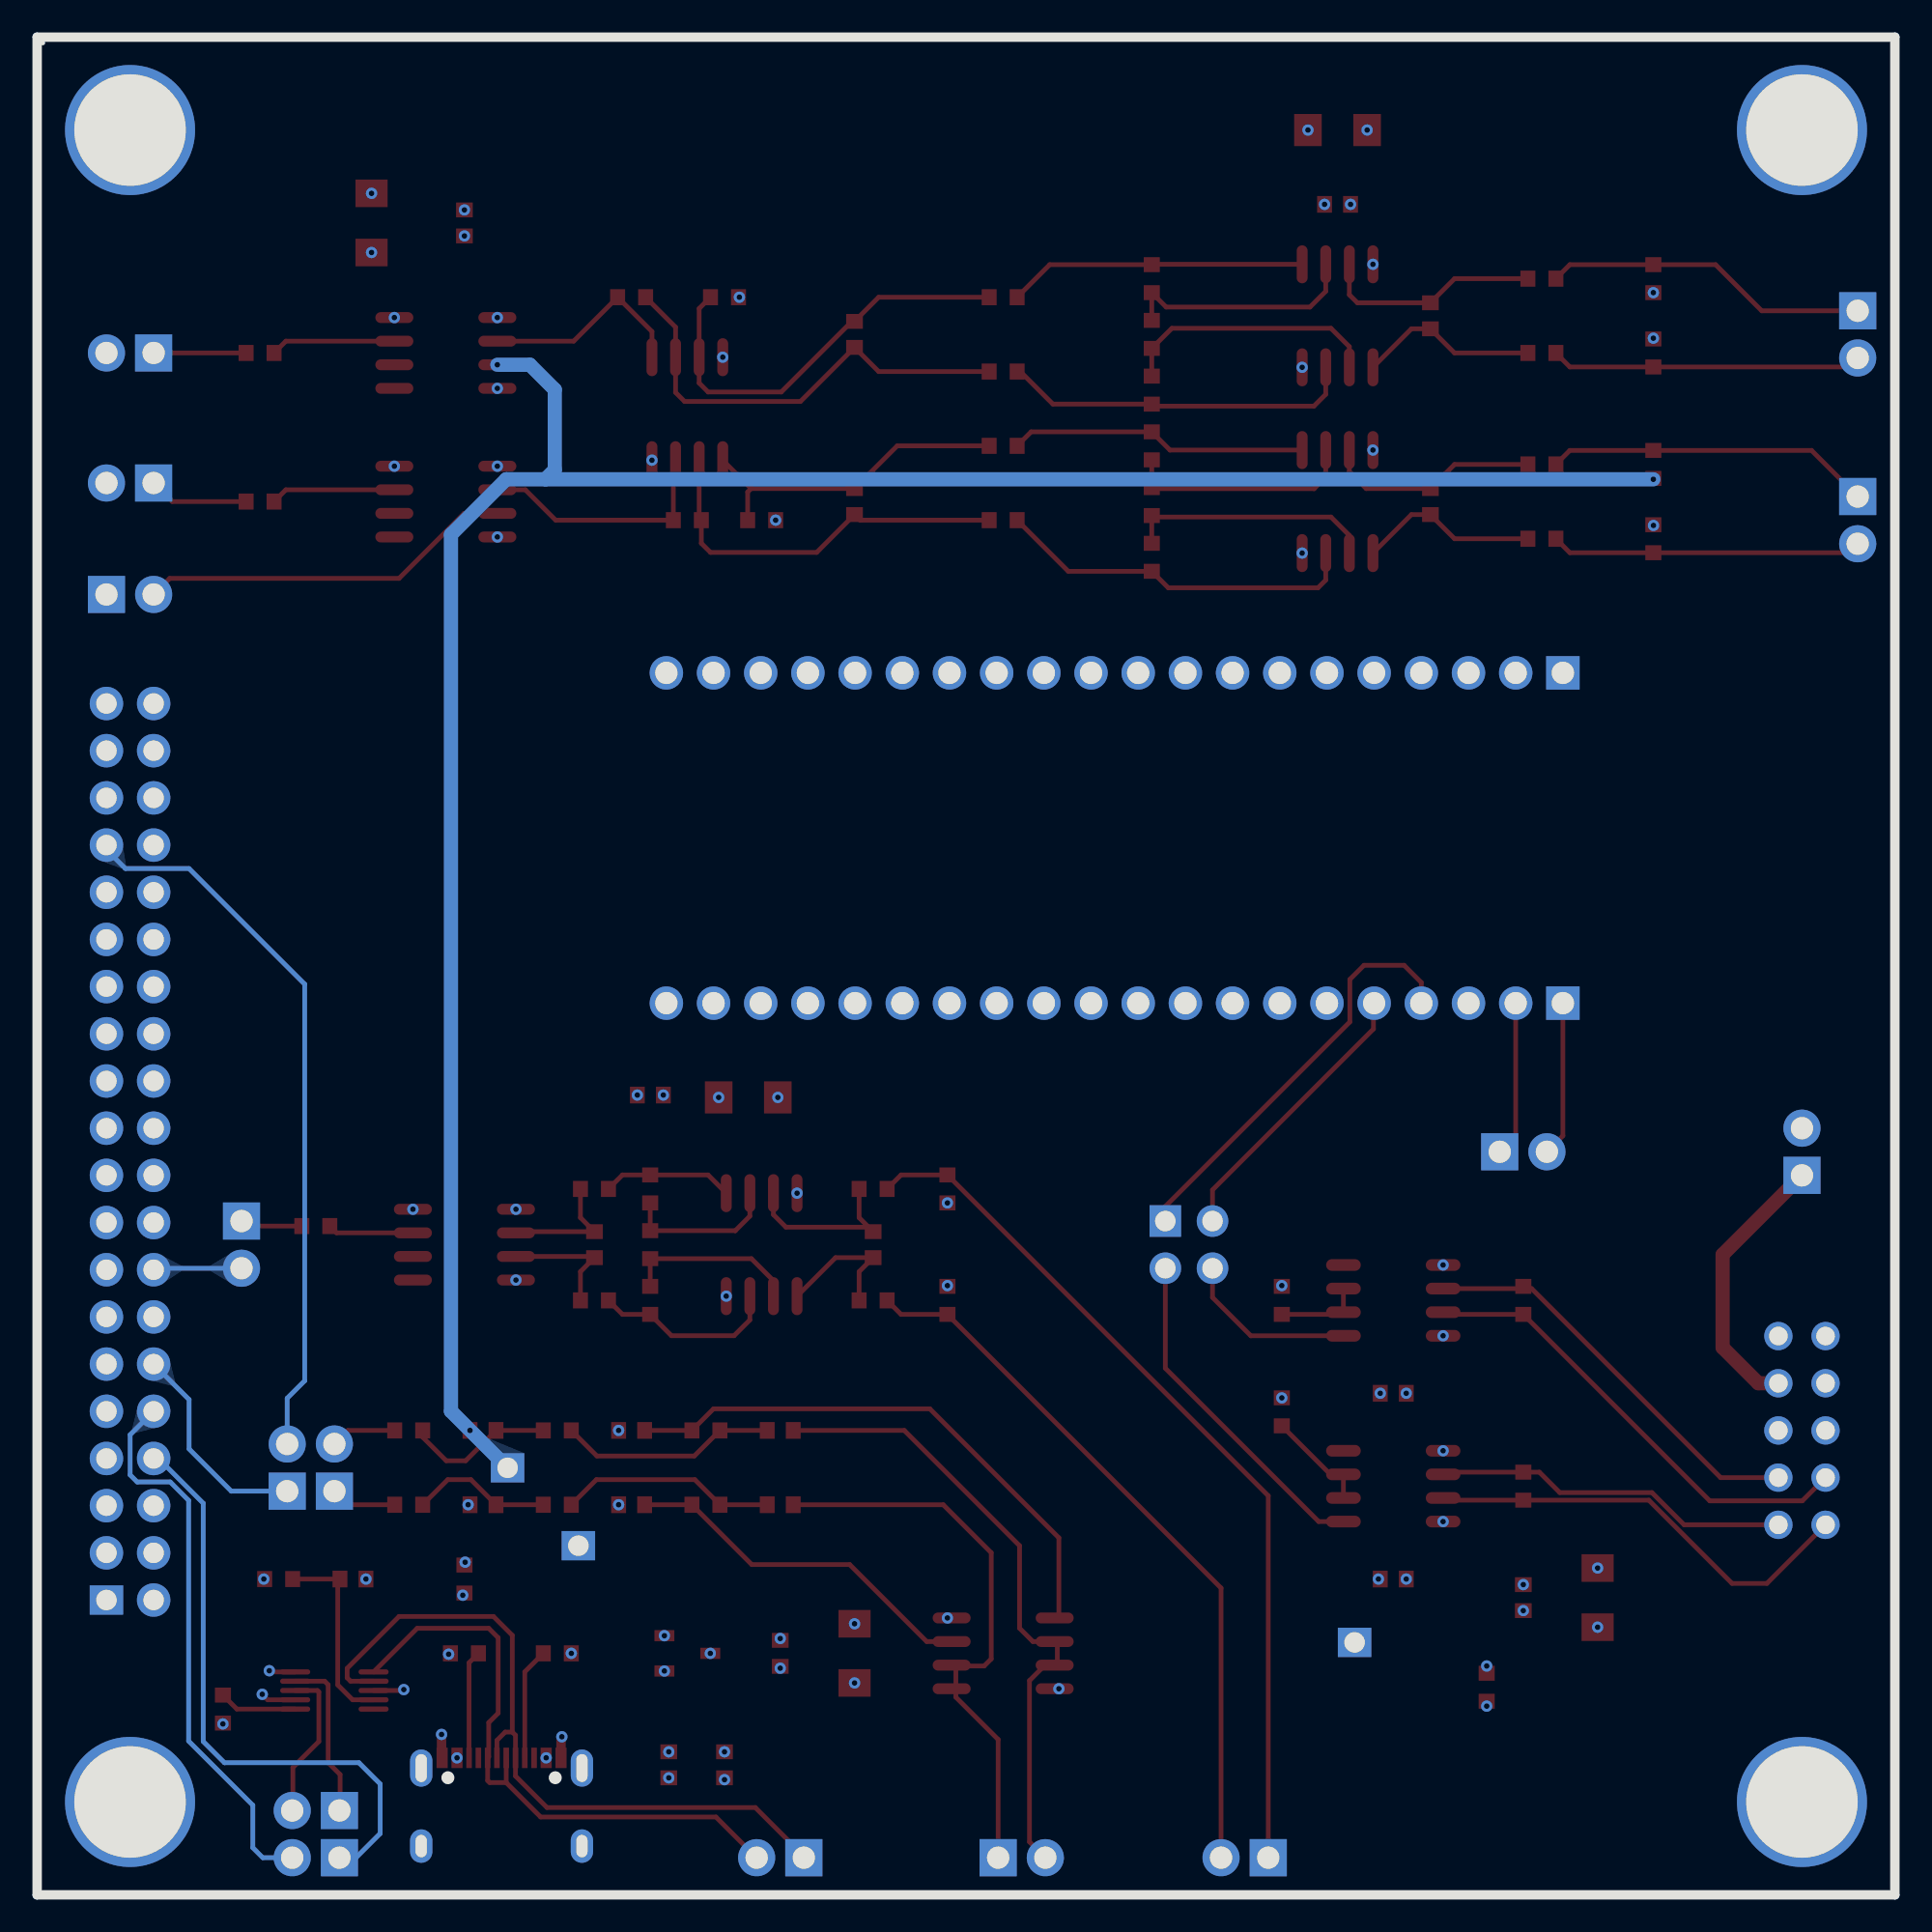
[diagram p3: board, bottom side, seen from below]

Outline 100 x 100 mm; copper layers: Top Layer, Inner1, Inner2, Bottom Layer. Coordinates in mm from the lower left corner of the outline.
Outline path: rectangle 99.69,99.69 99.7,99.69 ; 0,100 100,100 100,0 0,0 0,100
Stack: Top Layer 0.035mm / Dielectric1 0.48mm PP er 4.5 / Inner1 0.035mm / Dielectric2 0.48mm FR4 er 4.5 / Inner2 0.035mm / Dielectric3 0.48mm PP er 4.5 / Bottom Layer 0.035mm

## Design rules (mm)
spacing safeClearance (default): track to track 0.152, other pairs 0.152 to 0.3
track width trackWidth (default): min 0.127, default 0.508, max 2.54
differential pair differentialPair (default): width min 0.127, default 0.254, max 2.54; gap min 0.152, default 0.152
via viaSize (default): diameter min 0.5, default 0.61, max 10; hole min 0.3, default 0.305, max 6

## Placement (name value [footprint] x y rotation side)
C1  110nF  [C0603]  76 21 180 top
C2  16nF  [C0603]  68 21 180 top
C3  280nF  [C0603]  60 21 180 top
C4  110nF  [C0603]  76 25 180 top
C5  16nF  [C0603]  68 25 180 top
C6  470nF  [C0603]  63 7 90 top
C7  280nF  [C0603]  60 25 180 top
C8  100nF  [C0603]  55 35 90 top
C9  100nF  [C0603]  70 35 90 top
C10  100nF  [C0603]  27 17 180 top
C11  100nF  [C0603]  27 27 180 top
C12  100nF  [C0603]  25 85 90 top
C13  100nF  [C0603]  56 84 90 top
C14  100nF  [C0603]  25 75 90 top
C15  100nF  [C0603]  56 75 90 top
C16  100nF  [C0603]  60 13 270 top
C17  10uF  [C1206]  56 13 270 top
C18  100nF  [C0603]  66.99 43.05 0 top
C19  10uF  [C1206]  61.72 42.93 0 top
C20  100nF  [C0603]  30 91 0 top
C21  10uF  [C1206]  30 95 0 top
C22  100nF  [C0603]  77 90 90 top
C23  10uF  [C1206]  82 90 90 top
C24  100nF  [C0603]  20 16 90 top
C25  10uF  [C1206]  16 16 90 top
C26  100nF  [C0603]  66 7 270 top
C27  100nF  [C0603]  83 17 180 top
GY  -  [HDR-TH_2P-P2.54-V-F]  35 2 0 top
H1  -  [HDR-TH_2P-P2.54-V-F]  84 23 90 top
H2  -  [HDR-TH_2P-P2.54-V-F]  86.54 23 90 top
H3  -  [HDR-TH_2P-P2.54-V-F]  2 84 270 top
H4  B-2100S40P-B110  [HDR-TH_40P-P2.54-V-M-R2-C20-S2.54]  95 40 90 top
H6  -  [HDR-TH_2P-P2.54-V-F]  89 35 270 top
H7  -  [HDR-TH_2P-P2.54-V-F]  5 40 90 top
H8  -  [HDR-TH_20P-P2.54-V-F]  42 48 0 top
H9  -  [HDR-TH_20P-P2.54-V-F]  42 65.78 0 top
H12  -  [HDR-TH_2P-P2.54-V-F]  2 74 270 top
H13  -  [HDR-TH_2P-P2.54-V-F]  95 83 0 top
H14  -  [HDR-TH_2P-P2.54-V-F]  95 76 0 top
H15  PZ254V-12-4P  [HDR-TH_4P-P2.54-V-M-R2-C2-S2.54]  38 35 180 top
H16  -  [HDR-TH_2P-P2.54-V-F]  95 70 180 top
H17  -  [HDR-TH_2P-P2.54-V-F]  20 40 180 top
H18  -  [HDR-TH_2P-P2.54-V-F]  85 4.54 0 top
H19  -  [HDR-TH_2P-P2.54-V-F]  60 2 0 top
JL  -  [HDR-TH_2P-P2.54-V-F]  47 2 180 top
NOREF  -  [Pad_e1068]  70.87 18.8 90 top
NOREF#2  -  [Pad_e278]  5 5 0 top
NOREF#3  -  [Pad_e912]  74.68 22.99 90 top
NOREF#4  -  [Pad_e1070]  29.08 13.59 90 top
NOREF#5  -  [Pad_e283]  5 95 0 top
NOREF#6  -  [Pad_e284]  95 95 0 top
NOREF#7  -  [Pad_e285]  95 5 0 top
P1  2.54-2*5P简牛  [IDC-TH_10P-P2.54_C5665]  5 25 270 top
R1  1K  [R0603]  80 21 180 top
R2  1K  [R0603]  72 21 180 top
R3  1K  [R0603]  64 21 0 top
R4  1K  [R0603]  80 25 180 top
R5  1K  [R0603]  72 25 180 top
R6  1K  [R0603]  64 25 0 top
R7  150  [R0603]  20 32 270 top
R10  20K  [R0603]  51 38 90 top
R11  20K  [R0603]  51 32 90 top
R12  1K  [R0603]  55 38 180 top
R13  1K  [R0603]  55 32 180 top
R14  10K  [R0603]  67 38 90 top
R15  10K  [R0603]  67 32 90 top
R16  1 K  [R0603]  67 35 90 top
R17  1K  [R0603]  70 38 180 top
R18  1K  [R0603]  70 32 180 top
R19  0  [R0603]  85 36 0 top
R20  150  [R0603]  20 22 270 top
R21  10K  [R0603]  33 26 90 top
R22  10K  [R0603]  33 32 90 top
R23  20K  [R0603]  13 87 90 top
R24  20K  [R0603]  13 83 90 top
R25  10K  [R0603]  21.97 11.18 270 top
R26  10K  [R0603]  77 17 90 top
R27  1K  [R0603]  19 87 180 top
R28  1K  [R0603]  19 83 180 top
R29  10K  [R0603]  40 87 90 top
R30  10K  [R0603]  40 81 90 top
R31  1 K  [R0603]  40 84 90 top
R32  1K  [R0603]  48 86 180 top
R33  1K  [R0603]  48 82 180 top
R34  0  [R0603]  88 83 0 top
R35  0  [R0603]  88 75 0 top
R36  20K  [R0603]  13 77 90 top
R37  20K  [R0603]  13 73 90 top
R38  1K  [R0603]  19 77 180 top
R39  1K  [R0603]  19 73 180 top
R40  10K  [R0603]  40 78 90 top
R41  10K  [R0603]  40 72 90 top
R42  1 K  [R0603]  40 75 90 top
R43  1K  [R0603]  48 78 180 top
R44  1K  [R0603]  48 74 180 top
R45  10K  [R0603]  68 86 0 top
R46  10K  [R0603]  65 74 180 top
R47  10K  [R0603]  63 86 0 top
R48  10K  [R0603]  61 74 180 top
R49  1K  [R0603]  72 13 0 top
R50  1K  [R0603]  77 13 180 top
R51  10K  [R0603]  90 10 90 top
R52  10K  [R0603]  87 17 180 top
U1  MAX3485ED  [SOP-8_L4.9-W3.9-P1.27-LS6.0-BL]  27 32 90 top
U2  OPA2277U  [SOIC-8_L4.9-W3.9-P1.27-LS6.0-BL]  30 85 180 top
U3  OPA2277U  [SOIC-8_L4.9-W3.9-P1.27-LS6.0-BL]  65 80 180 top
U4  REF3025AIDBZR  [SOT-23-3_L2.9-W1.6-P1.90-LS2.8-BR]  65 13 0 top
U6  OPA2277U  [SOIC-8_L4.9-W3.9-P1.27-LS6.0-BL]  61 35 180 top
U7  LM211D  [SOIC-8_L4.9-W3.9-P1.27-LS6.0-BL]  77 35 270 top
U8  MAX3485ED  [SOP-8_L4.9-W3.9-P1.27-LS6.0-BL]  27 22 90 top
U9  LM211D  [SOIC-8_L4.9-W3.9-P1.27-LS6.0-BL]  78 83 270 top
U10  LM211D  [SOIC-8_L4.9-W3.9-P1.27-LS6.0-BL]  78 75 270 top
U11  OPA2277U  [SOIC-8_L4.9-W3.9-P1.27-LS6.0-BL]  30 75 180 top
U11#2  -  [SOIC-8_L4.9-W3.9-P1.27-LS6.0-BL]  48 13 90 top
U13  CH340X  [MSOP-10_L3.0-W3.0-P0.50-LS5.0-BL]  84 11 270 top
UART  -  [HDR-TH_2P-P2.54-V-F]  85 2 0 top
USB2  TYPE-C 16PIN 2MD(073)  [USB-C-SMD_TYPE-C-6PIN-2MD-073]  75 5 0 top

## Footprints (pads in the part's own frame, mm; a bottom-side part is the same pattern mirrored in y, then rotated)
C0603
  rect 0.8x0.9 smd: 1(-0.7,0) 2(0.7,0)
C1206
  rect 1.485x1.728 smd: 1(-1.593,0) 2(1.593,0)
HDR-TH_2P-P2.54-V-F
  rect 1.999x1.999 hole 1.199: 1(-1.27,0)
  round 1.999 hole 1.199: 2(1.27,0)
HDR-TH_4P-P2.54-V-M-R2-C2-S2.54
  rect 1.7x1.7 hole 1.1: 1(-1.27,-1.27)
  round 1.7 hole 1.1: 2(-1.27,1.27) 3(1.27,-1.27) 4(1.27,1.27)
HDR-TH_20P-P2.54-V-F
  rect 1.8x1.8 hole 1.2: 1(-24.13,0)
  round 1.8 hole 1.2: 2(-21.59,0) 3(-19.05,0) 4(-16.51,0) 5(-13.97,0) 6(-11.43,0) 7(-8.89,0) 8(-6.35,0) 9(-3.81,0) 10(-1.27,0) 11(1.27,0) 12(3.81,0) 13(6.35,0) 14(8.89,0) 15(11.43,0) 16(13.97,0) 17(16.51,0) 18(19.05,0) 19(21.59,0) 20(24.13,0)
HDR-TH_40P-P2.54-V-M-R2-C20-S2.54
  rect 1.575x1.8 hole 1.1: 1(-24.13,-1.27)
  round 1.8 hole 1.1: 2(-24.13,1.27) 3(-21.59,-1.27) 4(-21.59,1.27) 5(-19.05,-1.27) 6(-19.05,1.27) 7(-16.51,-1.27) 8(-16.51,1.27) 9(-13.97,-1.27) 10(-13.97,1.27) 11(-11.43,-1.27) 12(-11.43,1.27) 13(-8.89,-1.27) 14(-8.89,1.27) 15(-6.35,-1.27) 16(-6.35,1.27) 17(-3.81,-1.27) 18(-3.81,1.27) 19(-1.27,-1.27) 20(-1.27,1.27) 21(1.27,-1.27) 22(1.27,1.27) 23(3.81,-1.27) 24(3.81,1.27) 25(6.35,-1.27) 26(6.35,1.27) 27(8.89,-1.27) 28(8.89,1.27) 29(11.43,-1.27) 30(11.43,1.27) 31(13.97,-1.27) 32(13.97,1.27) 33(16.51,-1.27) 34(16.51,1.27) 35(19.05,-1.27) 36(19.05,1.27) 37(21.59,-1.27) 38(21.59,1.27) 39(24.13,-1.27) 40(24.13,1.27)
IDC-TH_10P-P2.54_C5665
  round 1.524 hole 1: 1(-5.08,-1.27) 2(-5.08,1.27) 3(-2.54,-1.27) 4(-2.54,1.27) 5(0,-1.27) 6(0,1.27) 7(2.54,-1.27) 8(2.54,1.27) 9(5.08,-1.27) 10(5.08,1.27)
MSOP-10_L3.0-W3.0-P0.50-LS5.0-BL
  oval 0.28x1.62 smd: 1(-1,-2.11) 2(-0.5,-2.11) 3(0,-2.11) 4(0.5,-2.11) 5(1,-2.11) 6(1,2.11) 7(0.5,2.11) 8(0,2.11) 9(-0.5,2.11) 10(-1,2.11)
Pad_e278
  round 7 hole 6: 1(0,0)
Pad_e283
  round 7 hole 6: 2(0,0)
Pad_e284
  round 7 hole 6: 3(0,0)
Pad_e285
  round 7 hole 6: 4(0,0)
Pad_e912
  rect 1.575x1.8 hole 1.1: 1(0,0)
Pad_e1068
  rect 1.575x1.8 hole 1.1: 2(0,0)
Pad_e1070
  rect 1.575x1.8 hole 1.1: 3(0,0)
R0603
  rect 0.806x0.864 smd: 1(-0.753,0) 2(0.753,0)
SOIC-8_L4.9-W3.9-P1.27-LS6.0-BL
  oval 0.588x2.045 smd: 1(-1.905,-2.772) 2(-0.635,-2.772) 3(0.635,-2.772) 4(1.905,-2.772) 5(1.905,2.772) 6(0.635,2.772) 7(-0.635,2.772) 8(-1.905,2.772)
SOP-8_L4.9-W3.9-P1.27-LS6.0-BL
  oval 0.63x1.865 smd: 1(-1.905,-2.683) 2(-0.635,-2.683) 3(0.635,-2.683) 4(1.905,-2.683) 5(1.905,2.683) 6(0.635,2.683) 7(-0.635,2.683) 8(-1.905,2.683)
SOT-23-3_L2.9-W1.6-P1.90-LS2.8-BR
  rect 1.07x0.6 smd: 1(1.235,-0.95) 2(1.235,0.95) 3(-1.235,0)
USB-C-SMD_TYPE-C-6PIN-2MD-073
  rect 0.6x1.1 smd: 1(-3.2,2.375) 2(-2.4,2.375) 11(2.4,2.375) 12(3.2,2.375)
  rect 0.3x1.1 smd: 3(-1.75,2.375) 4(-1.25,2.375) 5(-0.75,2.375) 6(-0.25,2.375) 7(0.25,2.375) 8(0.75,2.375) 9(1.25,2.375) 10(1.75,2.375)
  oval 1.2x2 hole 0.6x1.5: 13(-4.325,1.825) 14(4.325,1.825)
  oval 1.2x1.8 hole 0.6x1.2: 13(-4.325,-2.375) 14(4.325,-2.375)

## Nets
As in the schematic, except:
2.5V: C1.1 C2.1 C4.1 C5.1 NOREF#3.1 R10.1 R11.2 R23.1 R24.2 R36.1 R37.2 U4.2 U9.3
5V: H4.4
+5V: C6.2 C10.2 C11.2 C16.2 C17.2 C18.2 C19.2 C20.2 C21.2 C22.2 C23.2 C24.2 C25.2 C26.1 H7.2 H9.1 H9.2 R52.1 U1.8 U2.8 U3.8 U4.1 U6.8 U7.8 U8.8 U9.8 U10.8 U11.8 U11#2.8 U13.7 U13.10 USB2.2 USB2.11
AGND: C16.1 C17.1 C18.1 C19.1 C20.1 C21.1 C22.1 C23.1 NOREF.2 R26.2 R47.1 R48.2 U2.4 U3.4 U6.4 U7.1 U7.4 U9.1 U9.4 U10.1 U10.4 U11.4 U11#2.4
GND: C6.1 C26.2 C27.2 H4.6 H4.9 H4.14 H4.20 H4.25 H4.30 H4.34 H4.39 H8.3 H8.8 H8.13 H8.18 H9.3 H9.8 H9.13 H9.18 NOREF#2.1 NOREF#5.2 NOREF#6.3 NOREF#7.4 R25.2 R26.1 R49.1 R50.1 R51.1 U4.3 U13.3 USB2.1 USB2.12
PGND: C10.1 C11.1 C24.1 C25.1 NOREF#4.3 P1.1 P1.2 R21.2 R22.2 R25.1 U1.5 U8.5
JLINA: C2.2 R3.2 U11#2.3
JLINB: C5.2 R6.2 U11#2.5
JLOUTA: C3.2 JL.1 U11#2.1 U11#2.2
JLOUTB: C7.2 JL.2 U11#2.6 U11#2.7
NSTR: C27.1 R52.2 U13.4
S+: GY.1 R10.2 R12.2
S-: GY.2 R11.1 R13.2

Pads without a net: H4 1 2 17; H9 5; H13 2; H14 2; H16 1; P1 3; U1 4; U7 5 6; U8 4; U9 5 6; U10 5 6; U13 5; USB2 3 9 13 14

## Via types
v1: diameter 0.61, hole 0.305, Top Layer to Bottom Layer, 85 vias

## Routing (per net, layer and track width the routed paths; a pad name or vN(x,y) marks a point on that pad's centre or on a via; arc(x,y) is an arc through that point)
2.5V: length 126.1
  Bottom Layer w0.762: 72.64,76.2 72.14,76.71 72.14,81.03 73.47,82.36 v1(75.23,82.36) ; 72.64,76.2 74.75,76.2 77.72,73.22 77.72,26.03 NOREF#3.1 ; 72.64,76.2 v1(13,76.2)
  vias: v1(13,86.25) v1(13,83.8) v1(12.99,73.72) v1(51,37.25) v1(51,32.8) v1(66.24,13.95) v1(68.7,25) v1(68.7,21) v1(76.7,25) v1(76.8,21)
+5V: length 3.3
  Top Layer w0.254: U13.7 87.59,10.5 v1(87.88,10.79) ; v1(87.5,12.06) 87.44,12 U13.10
  vias: v1(16,17.59) v1(20,16.7) v1(24.32,30.09) v1(24.32,20.09) v1(26.3,27) v1(26.3,17) v1(30.7,91) v1(31.59,95) v1(31.91,82.23) v1(31.91,72.23) v1(45,11.09) v1(56,11.41) v1(60,12.2) v1(62.91,32.23) v1(63,7.7) v1(63.31,42.93) v1(66,7.7) v1(66.24,12.05) v1(66.91,77.23) v1(67.69,43.05) v1(72.6,7.38) v1(77,90.7) v1(77.4,7.38) v1(79.77,36.91) v1(80.77,84.91) v1(80.77,76.91) v1(82,91.59) v1(87.8,17)
AGND: length 0.2
  Top Layer w0.508: v1(76.96,17.91) 76.96,17.79 R26.2
  vias: v1(28.09,87.77) v1(28.09,77.77) v1(28.41,95) v1(29.3,91) v1(51,14.91) v1(56,14.59) v1(59.09,37.77) v1(60,13.8) v1(60.13,42.93) v1(60.25,74) v1(62.2,86) v1(63.09,82.77) v1(66.29,43.05) v1(74.23,36.91) v1(74.23,33.09) v1(75.23,84.91) v1(75.23,81.09) v1(75.23,76.91) v1(75.23,73.09) v1(77,89.3) v1(82,88.41)
GND: length 4.5
  Top Layer w0.254: U13.3 80.31,11 v1(80.26,11.05)
  Top Layer w0.508: R26.1 77,16.22 v1(77.09,16.13) ; USB2.12 78.23,7.41 v1(78.23,8.64) ; v1(71.75,8.51) 71.8,8.46 USB2.1 ; v1(21.97,10.16) R25.2
  vias: v1(63,6.2) v1(63.76,13) v1(66,6.3) v1(71.25,13) v1(77.85,12.95) v1(82.3,17) v1(90,9.2)
PGND: length 0.4
  Top Layer w0.508: v1(21.97,12.32) R25.1
  vias: v1(16,14.41) v1(20,15.3) v1(24.32,33.91) v1(24.32,23.91) v1(27.7,27) v1(27.8,17) v1(33,32.8) v1(33,26.75)
A1: length 19.3
  Top Layer w0.254: P1.10 11.34,19.92 13.08,21.65 18.04,21.65 19.14,22.75 R20.1 24.2,22.75 U8.6
A2: length 22.4
  Top Layer w0.254: 20.12,32.64 R7.1 ; 20.12,32.64 19.55,32.64 9.38,22.46 P1.8 ; 20.12,32.64 U1.6
B1: length 23.8
  Top Layer w0.254: P1.9 6.89,16.76 8.76,16.76 13.25,21.25 R20.2 24.2,21.25 U8.7
B2: length 25.3
  Top Layer w0.254: P1.7 4.98,21.21 9.96,21.21 R7.2 24.2,31.25 U1.7
CPURXD: length 8.3
  Top Layer w0.254: H18.2 86.23,4.58 86.23,6.86 84.84,8.25 84.84,10.92 84.91,11 U13.8
CPUTXD: length 8.9
  Top Layer w0.254: H18.1 83.69,4.58 83.69,6.48 84.34,7.12 84.34,11.31 84.53,11.5 U13.9
DACOUT: length 20.3
  Top Layer w0.254: U10.3 77.02,74.36 80.52,70.87 92.86,70.87 H16.2
GPIO1: length 11.6
  Bottom Layer w0.254: H2.1 89.55,21.73 91.82,24 91.82,26.66 H4.12
GPIO4: length 4.8
  Bottom Layer w0.254: H4.16 93.65,33.73 H6.2
GPIO15: length 32.4
  Bottom Layer w0.254: H4.8 93.47,23.49 91.06,21.08 91.06,8.25 89.92,7.11 82.68,7.11 81.53,5.97 81.53,3.3 82.84,2 UART.1
GPIO16: length 30.1
  Bottom Layer w0.254: UART.2 87.85,2 88.39,2.54 88.39,4.83 91.85,8.28 91.85,21.23 92.84,22.22 94.62,22.22 95,22.61 95,24.76 H4.10
GPIO23: length 39.1
  Bottom Layer w0.254: H2.2 86.54,26.73 85.6,27.67 85.6,49.02 91.82,55.25 95.25,55.25 96.27,56.27 H4.33
GYINA+: length 9.2
  Top Layer w0.254: C8.2 55.24,35.94 ; 55.24,35.94 59.69,35.94 60.37,36.62 U6.3 ; 55.24,35.94 55.75,36.45 R12.1
GYINA-: length 8.4
  Top Layer w0.254: R14.1 R16.2 62.42,35.75 62.42,35.75 61.63,36.54 U6.2
GYINB+: length 7.6
  Top Layer w0.254: R13.1 55.75,33.55 C8.1 57.02,34.3 U6.5
GYINB-: length 9.5
  Top Layer w0.254: U6.6 60.37,33.06 61.55,34.25 R16.1 R15.2
GYLMIN+: length 6.9
  Top Layer w0.254: U7.2 74.16,35.7 C9.2 70.75,36.45 R17.1
GYLMIN-: length 6.9
  Top Layer w0.254: R18.1 70.75,33.55 C9.1 70.06,34.36 U7.3
GYOUTA: length 7.1
  Top Layer w0.254: R17.2 68.49,38.75 R14.2 63.89,38.75 U6.1
GYOUTB: length 10
  Top Layer w0.254: U6.7 61.63,30.95 62.48,30.1 65.85,30.1 R15.1 68.49,31.25 R18.2
JLINA: length 19.4
  Top Layer w0.254: 51,13.63 52.12,13.63 56.26,17.78 61.53,17.78 R3.2 C2.2
JLINB: length 30
  Top Layer w0.254: C5.2 R6.2 63.59,26.16 51.94,26.16 45,19.22 45,14.91
JLINTA: length 3.5
  Top Layer w0.254: H1.1 83.27,21 R1.1
JLINTB: length 3.5
  Top Layer w0.254: H1.2 83.27,25 R4.1
JLOUTA: length 30.8
  Top Layer w0.254: JL.1 48.27,8.37 50.55,10.64 50.55,12.32 49.02,12.32 48.64,12.7 48.64,18.41 51.23,21 C3.2
JLOUTB: length 34.6
  Top Layer w0.254: C7.2 53.32,25 47.12,18.8 47.12,14.35 46.4,13.63 45.14,13.63 ; 45.14,13.63 45,13.63 ; 45.14,13.63 45.09,13.58 45.09,12.37 45.75,12.37 46.58,11.53 46.58,2.85 JL.2
NSTR: length 10.6
  Top Layer w0.254: U13.4 83.02,10.5 83.82,11.3 83.82,16.88 C27.1 R52.2
OGA: length 18.4
  Top Layer w0.254: H15.2 39.27,28.35 31.02,20.09 U8.1
OGB: length 9.5
  Top Layer w0.254: H15.4 36.73,32.16 34.67,30.09 U1.1
PICOGP0: length 8.4
  Top Layer w0.254: H17.2 17.87,40.86 H8.1
PICOGP1: length 8.4
  Top Layer w0.254: H17.1 20.41,40.86 H8.2
PICOGP2: length 22.8
  Top Layer w0.254: H8.4 25.49,49.11 26.42,50.04 28.57,50.04 29.34,49.28 29.34,46.99 39.27,37.06 H15.1
PICOGP3: length 15.3
  Top Layer w0.254: H8.5 28.07,47.96 28.07,46.61 36.73,37.95 H15.3
QGYINA+: length 12
  Top Layer w0.254: R27.1 23.7,87 C12.2 28.93,85.7 29.37,86.13 U2.3
QGYINA+1: length 11.7
  Top Layer w0.254: R38.1 23.7,77 C14.2 28.46,75.7 29.37,76.61 U11.3
QGYINA-: length 13
  Top Layer w0.254: R31.2 R29.1 39.22,85.47 31.48,85.47 30.63,86.32 U2.2
QGYINA-1: length 12.6
  Top Layer w0.254: U11.2 30.63,76.32 31.26,75.69 39.94,75.69 R42.2 R40.1
QGYINB+: length 9.7
  Top Layer w0.254: R28.1 23.7,83 C12.1 26.02,84.3 U2.5
QGYINB+1: length 9.7
  Top Layer w0.254: U11.5 26.02,74.3 C14.1 23.7,73 R39.1
QGYINB-: length 14.1
  Top Layer w0.254: U2.6 29.37,83.34 30.35,84.33 38.92,84.33 R31.1 R30.2
QGYINB-1: length 13.5
  Top Layer w0.254: R41.2 40,74.09 39.92,74.17 ; 39.92,74.17 30.35,74.17 29.37,73.18 U11.6 ; 39.92,74.17 R42.1
QGYLMIN+: length 22.8
  Top Layer w0.254: R32.1 54.7,86 C13.2 56.14,84.7 59.94,80.9 63.88,80.9 64.37,81.38 U3.3 64.37,85.39 R47.2
QGYLMIN+1: length 17.7
  Top Layer w0.254: R48.1 61.75,75.51 61.57,75.7 ; R43.1 53.7,78 C15.2 61.57,75.7 ; 61.57,75.7 U3.5
QGYLMIN-: length 24.6
  Top Layer w0.254: R33.1 54.7,82 C13.1 58.91,80.39 65.15,80.39 65.63,80.88 U3.2 65.63,84.39 R45.1
QGYLMIN-1: length 21.2
  Top Layer w0.254: U3.6 64.37,74.12 R46.2 64.25,72.76 63.75,72.26 58.04,72.26 C15.1 55.7,74 R44.1
QGYOUTA: length 16.1
  Top Layer w0.254: U2.1 39.98,87.77 R29.2 45.49,87.75 R32.2
QGYOUTA1: length 16.1
  Top Layer w0.254: R43.2 46.49,78.75 R40.2 39.02,77.77 U11.1
QGYOUTB: length 18.9
  Top Layer w0.254: 47.07,82 45.32,80.25 R30.1 39.89,80.14 31.27,80.14 30.63,80.77 U2.7
QGYOUTB1: length 19.7
  Top Layer w0.254: U11.7 30.63,70.77 31.05,70.36 39.11,70.36 R41.1 44.49,71.25 R44.2
QOUT1: length 11.4
  Top Layer w0.254: U9.2 71.12,83.64 R45.2 66.91,84.15 U3.1
QOUT2: length 13.4
  Top Layer w0.254: U3.7 65.75,77.11 R46.1 72.09,74 73.72,75.64 U10.2
QS+: length 17.6
  Top Layer w0.254: H3.1 7.17,85.27 9.65,87.75 R23.2 17.49,87.75 R27.2
QS+1: length 17.6
  Top Layer w0.254: R38.2 17.49,77.75 R36.2 4.48,77.75 H12.1
QS-: length 16.8
  Top Layer w0.254: H3.2 2.48,82.25 R24.1 17.49,82.25 R28.2
QS-1: length 16.8
  Top Layer w0.254: R39.2 17.49,72.25 R37.1 2.48,72.25 H12.2
S+: length 47.5
  Top Layer w0.254: GY.1 33.73,21.48 R10.2 53.49,38.75 R12.2
S-: length 38.9
  Top Layer w0.254: GY.2 36.27,16.52 R11.1 53.49,31.25 R13.2
UD+: length 33.3
  Top Layer w0.254: H19.2 63.46,4.19 72.9,4.19 74.75,6.04 ; 74.75,6.04 75.64,6.04 75.75,6.15 USB2.8 75.69,7.43 75.69,9.27 75.18,9.78 75.18,13.84 75.69,14.35 79.54,14.35 U13.1 ; 74.75,6.04 USB2.6
UD-: length 39.5
  Top Layer w0.254: H19.1 58.73,2.09 61.34,4.7 72.56,4.7 74.25,6.39 USB2.5 74.25,8.59 74.42,8.76 ; 74.42,8.76 74.8,8.76 75.25,8.32 USB2.7 ; 74.42,8.76 74.42,13.97 75.44,14.99 80.52,14.99 83.31,12.19 83.31,11.68 83.13,11.5 U13.2
$1N3368: length 7.6
  Top Layer w0.254: R2.1 C1.2 76.65,22.35 77.89,22.35 R1.2
$1N3416: length 11.7
  Top Layer w0.254: C3.1 R3.1 64.6,22.35 69.89,22.35 R2.2
$1N13568: length 8.1
  Top Layer w0.254: R4.2 79.25,24.64 77.98,23.37 76.93,23.37 C4.2 R5.1
$1N13571: length 11.7
  Top Layer w0.254: R5.2 69.87,23.62 64.62,23.62 R6.1 C7.1
$1N16982: length 4.6
  Top Layer w0.254: U7.7 83.88,35.64 R19.1
$1N17068: length 3.4
  Top Layer w0.254: H6.1 88.73,36 R19.2
$1N26460: length 5.7
  Top Layer w0.254: R21.1 30.39,22.63 U8.3 U8.2
$1N26465: length 4.6
  Top Layer w0.254: R22.1 29.8,31.25 U1.2 U1.3
$1N26481: length 14.8
  Top Layer w0.762: H7.1 9.27,34.46 9.27,29.46 7.35,27.54 P1.4
$1N28900: length 6.7
  Top Layer w0.254: U9.7 86.61,83.64 R34.1
$1N28970: length 5
  Top Layer w0.254: H13.1 R34.2
$1N29245: length 6.7
  Top Layer w0.254: U10.7 86.61,75.64 R35.1
$1N29246: length 5.4
  Top Layer w0.254: R35.2 92.73,75 H14.1
$1N34544: length 6
  Top Layer w0.254: R49.2 73.75,12 USB2.4
$1N34597: length 5.8
  Top Layer w0.254: USB2.10 76.75,12.5 R50.2
$1N41821: length 4.2
  Top Layer w0.254: U13.6 89.25,10 R51.2

## Copper pours and planes (outline as drawn; the poured copper is in the pictures)
2.5V on Inner1: 11.3,88.9 13.72,88.9 13.72,71.75 11.3,71.75
2.5V on Inner1: 49.91,39.5 77.34,39.5 77.34,13.51 49.91,13.51
+5V on Inner1: 1.02,98.98 98.98,98.98 98.98,1.02 1.02,1.02
+5V on Inner1: 1.02,98.98 2.86,98.98 2.86,97.14 1.02,97.14
+5V on Inner1: 97.14,98.98 98.98,98.98 98.98,97.14 97.14,97.14
+5V on Inner1: 1.02,2.86 2.86,2.86 2.86,1.02 1.02,1.02
+5V on Inner1: 97.14,2.86 98.98,2.86 98.98,1.02 97.14,1.02
AGND on Inner2: 26.29,98.98 84.96,98.98 84.96,9.53 26.29,9.53
GND on Inner2: 1.02,98.98 98.98,98.98 98.98,1.02 1.02,1.02
PGND on Inner2: 1.14,34.64 33.91,34.64 33.91,11.68 1.14,11.68

Small or netless copper shapes (teardrops, artwork), in the pictures only: 236 on Top Layer, 6 on Bottom Layer, 4 on Inner1, 3 on Inner2

# Board PCB2
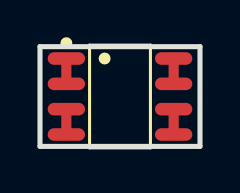
[diagram p4: board, top side]
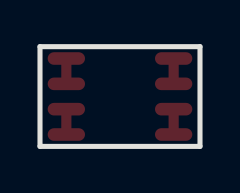
[diagram p5: board, bottom side, seen from below]

Outline 8 x 5 mm; copper layers: Top Layer, Bottom Layer. Coordinates in mm from the lower left corner of the outline.
Outline path: 0,5 8,5 8,0 0,0 0,5
Stack: Top Layer 0.035mm / Dielectric1 1.51mm FR4 er 4.5 / Bottom Layer 0.035mm

## Design rules (mm)
spacing safeClearance (default): track to track 0.152, other pairs 0.152 to 0.3
track width trackWidth (default): min 0.127, default 0.254, max 2.54
differential pair differentialPair (default): width min 0.127, default 0.254, max 2.54; gap min 0.152, default 0.152
via viaSize (default): diameter min 0.5, default 0.61, max 10; hole min 0.3, default 0.305, max 6

## Placement (name value [footprint] x y rotation side)
U1  CH340N  [SOP-8_L4.9-W3.9-P1.27-LS6.0-BL]  4 2.5 270 top

## Footprints (pads in the part's own frame, mm; a bottom-side part is the same pattern mirrored in y, then rotated)
SOP-8_L4.9-W3.9-P1.27-LS6.0-BL
  oval 0.63x1.865 smd: 1(-1.905,-2.683) 2(-0.635,-2.683) 3(0.635,-2.683) 4(1.905,-2.683) 5(1.905,2.683) 6(0.635,2.683) 7(-0.635,2.683) 8(-1.905,2.683)

## Nets
As in the schematic.

Pads without a net: U1 1 2 3 4 5 6 7 8

# Board PCB3
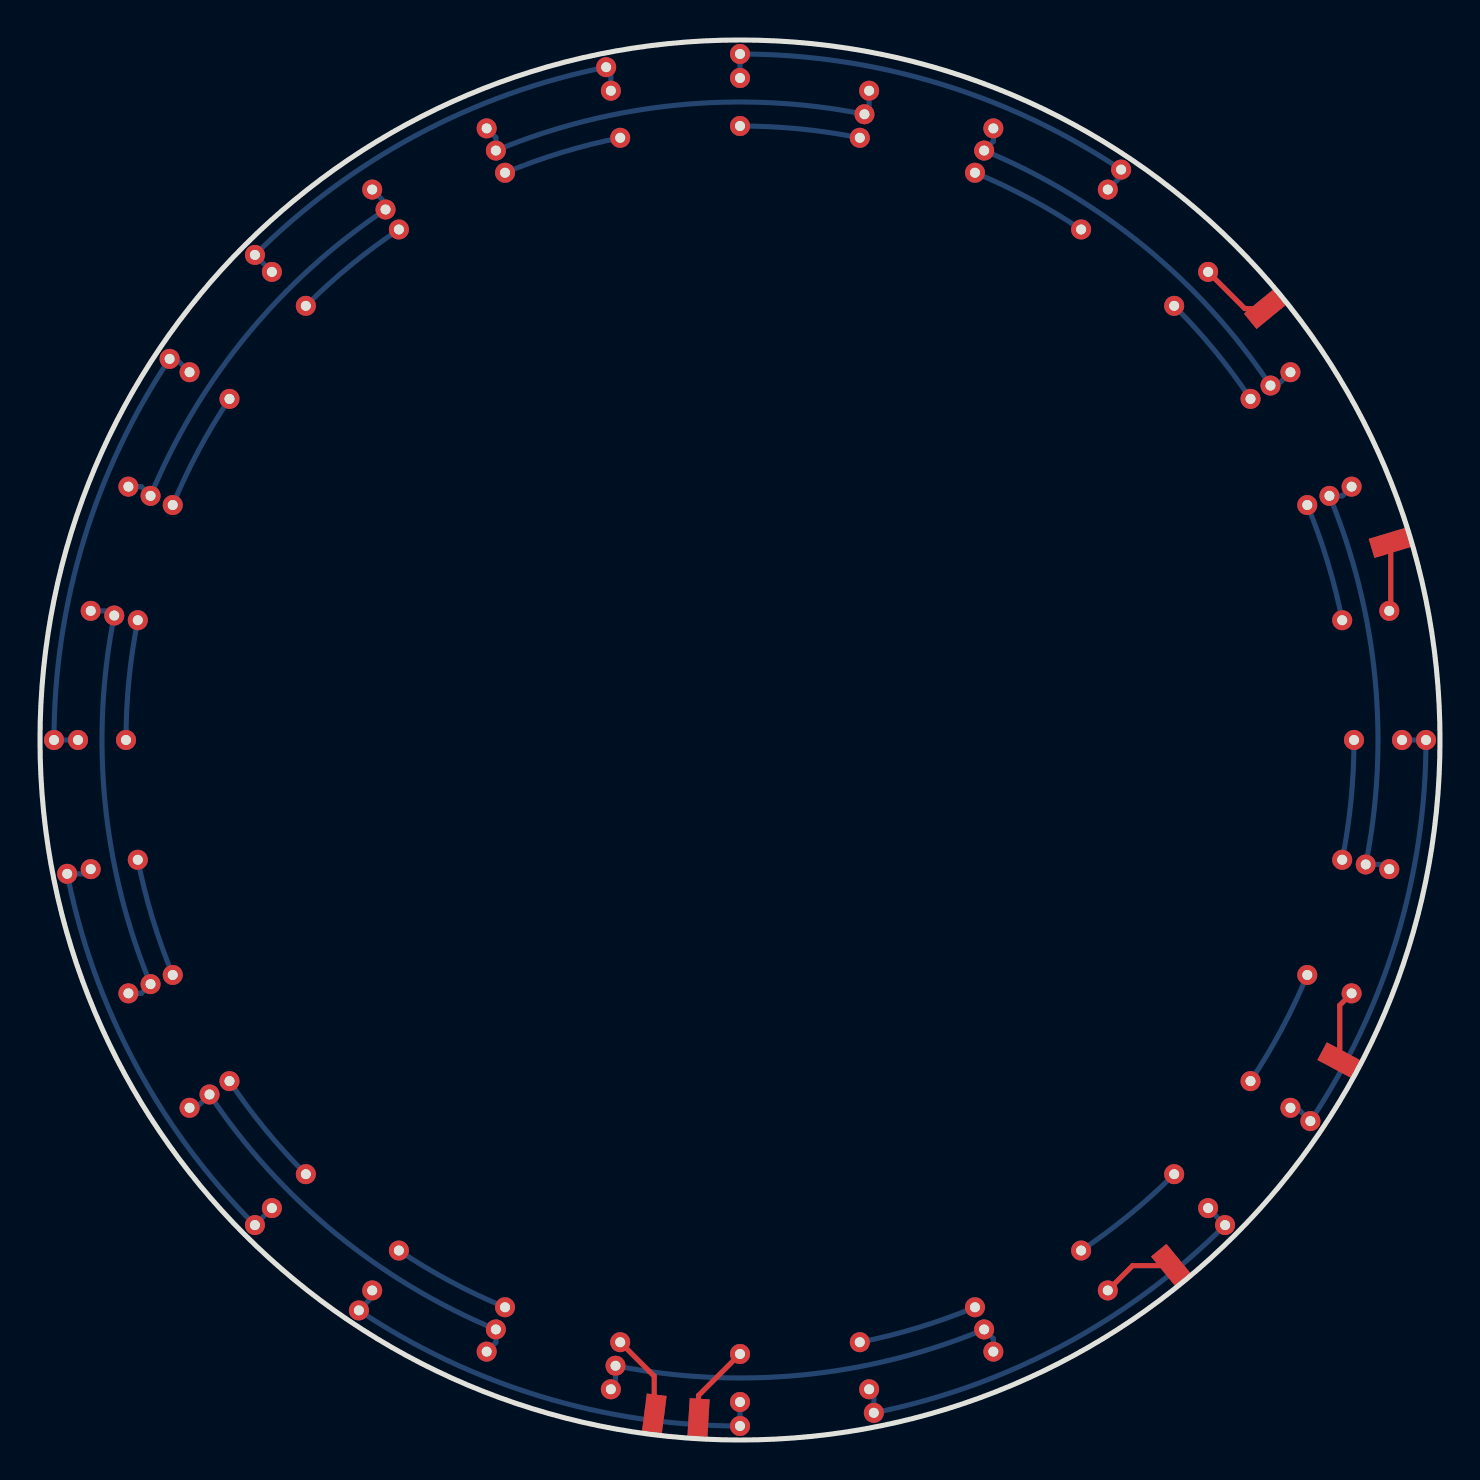
[diagram p6: board, top side]
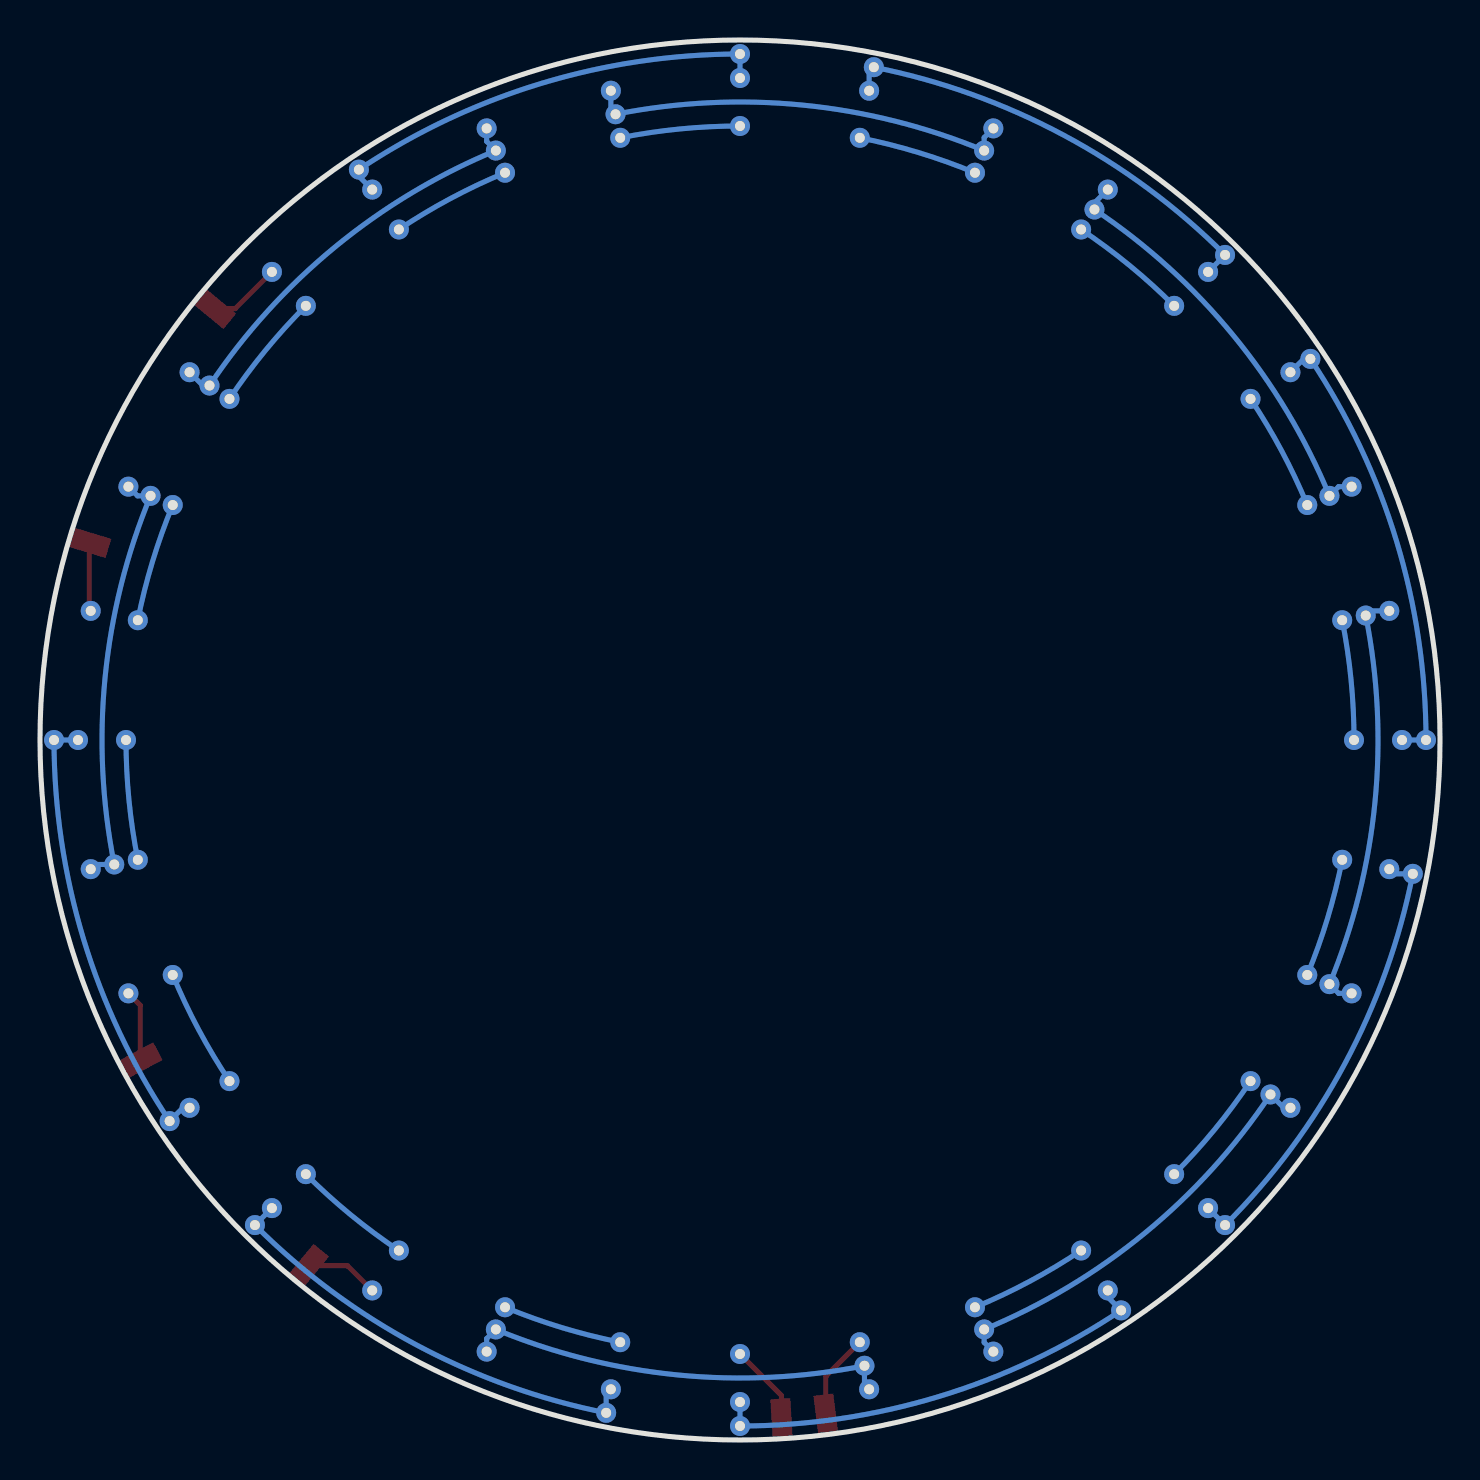
[diagram p7: board, bottom side, seen from below]

Outline 70 x 70 mm; copper layers: Top Layer, Bottom Layer. Coordinates in mm from the lower left corner of the outline.
Outline path: circle c35,35 r35
Stack: Top Layer 0.035mm / Dielectric1 1.51mm FR4 er 4.5 / Bottom Layer 0.035mm

## Design rules (mm)
spacing safeClearance (default): track to track 0.152, other pairs 0.152 to 0.3
track width trackWidth (default): min 0.127, default 0.254, max 2.54
differential pair differentialPair (default): width min 0.127, default 0.254, max 2.54; gap min 0.152, default 0.152
via viaSize (default): diameter min 0.5, default 0.61, max 10; hole min 0.3, default 0.305, max 6

## Placement (name value [footprint] x y rotation side)
NOREF  -  [Pad_e381]  11.59 11.59 0 top
NOREF#2  -  [Pad_e146]  22.79 5.53 0 top
NOREF#3  -  [Pad_e413]  10.75 10.75 0 top
NOREF#4  -  [Pad_e166]  4.89 29.01 0 top
NOREF#5  -  [Pad_e394]  69.3 35 0 top
NOREF#6  -  [Pad_e367]  58.41 11.59 0 top
NOREF#7  -  [Pad_e168]  65.11 40.99 0 top
NOREF#8  -  [Pad_e362]  68.1 35 0 top
NOREF#9  -  [Pad_e127]  47.21 64.47 0 top
NOREF#10  -  [Pad_e169]  60.53 17.94 0 top
NOREF#11  -  [Pad_e213]  29.01 65.11 0 top
NOREF#12  -  [Pad_e176]  6.64 46.75 0 top
NOREF#13  -  [Pad_e133]  22.79 64.47 0 top
NOREF#14  -  [Pad_e180]  9.47 17.94 0 top
NOREF#15  -  [Pad_e409]  0.7 35 0 top
NOREF#16  -  [Pad_e389]  63.52 15.94 0 top
NOREF#17  -  [Pad_e435]  30.71 1.27 352.8 top
NOREF#18  -  [Pad_e370]  2.54 41.46 0 top
NOREF#19  -  [Pad_e199]  56.71 13.29 0 top
NOREF#20  -  [Pad_e396]  10.75 59.25 0 top
NOREF#21  -  [Pad_e475]  64.99 18.97 61.9 top
NOREF#22  -  [Pad_e191]  9.47 52.06 0 top
NOREF#23  -  [Pad_e182]  23.25 6.64 0 top
NOREF#24  -  [Pad_e171]  63.36 46.75 0 top
NOREF#25  -  [Pad_e376]  16.61 7.48 0 top
NOREF#26  -  [Pad_e205]  40.99 65.11 0 top
NOREF#27  -  [Pad_e181]  13.29 13.29 0 top
NOREF#28  -  [Pad_e385]  41.46 2.54 0 top
NOREF#29  -  [Pad_e481]  61.28 56.57 129.4 top
NOREF#30  -  [Pad_e142]  5.53 22.79 0 top
NOREF#31  -  [Pad_e403]  28.31 68.64 0 top
NOREF#32  -  [Pad_e366]  53.39 7.48 0 top
NOREF#33  -  [Pad_e358]  65.58 22.33 0 top
NOREF#34  -  [Pad_e165]  4.89 40.99 0 top
NOREF#35  -  [Pad_e139]  3.71 41.22 0 top
NOREF#36  -  [Pad_e207]  40.99 4.89 0 top
NOREF#37  -  [Pad_e129]  41.22 66.29 0 top
NOREF#38  -  [Pad_e174]  52.06 60.53 0 top
NOREF#39  -  [Pad_e357]  62.52 16.61 0 top
NOREF#40  -  [Pad_e143]  8.48 17.28 0 top
NOREF#41  -  [Pad_e138]  5.53 47.21 0 top
NOREF#42  -  [Pad_e194]  17.94 9.47 0 top
NOREF#43  -  [Pad_e436]  32.92 1.06 356.5 top
NOREF#44  -  [Pad_e201]  63.36 23.25 0 top
NOREF#45  -  [Pad_e360]  65.58 47.67 0 top
NOREF#46  -  [Pad_e175]  46.75 63.36 0 top
NOREF#47  -  [Pad_e408]  15.94 6.48 0 top
NOREF#48  -  [Pad_e372]  41.46 67.46 0 top
NOREF#49  -  [Pad_e185]  23.25 63.36 0 top
NOREF#50  -  [Pad_e368]  47.67 4.42 0 top
NOREF#51  -  [Pad_e378]  2.54 28.54 0 top
NOREF#52  -  [Pad_e147]  28.78 3.71 0 top
NOREF#53  -  [Pad_e361]  22.33 65.58 0 top
NOREF#54  -  [Pad_e188]  17.94 60.53 0 top
NOREF#55  -  [Pad_e135]  17.28 61.52 0 top
NOREF#56  -  [Pad_e173]  56.71 56.71 0 top
NOREF#57  -  [Pad_e211]  35 65.7 0 top
NOREF#58  -  [Pad_e382]  22.33 4.42 0 top
NOREF#59  -  [Pad_e386]  35 1.9 0 top
NOREF#60  -  [Pad_e369]  67.46 41.46 0 top
NOREF#61  -  [Pad_e364]  11.59 58.41 0 top
NOREF#62  -  [Pad_e167]  65.7 35 0 top
NOREF#63  -  [Pad_e356]  16.61 62.52 0 top
NOREF#64  -  [Pad_e120]  61.52 52.72 0 top
NOREF#65  -  [Pad_e473]  56.57 8.72 39.4 top
NOREF#66  -  [Pad_e365]  7.48 53.39 0 top
NOREF#67  -  [Pad_e380]  53.39 62.52 0 top
NOREF#68  -  [Pad_e371]  28.54 67.46 0 top
NOREF#69  -  [Pad_e410]  1.36 28.31 0 top
NOREF#70  -  [Pad_e399]  59.25 10.75 0 top
NOREF#71  -  [Pad_e119]  64.47 47.21 0 top
NOREF#72  -  [Pad_e363]  62.52 53.39 0 top
NOREF#73  -  [Pad_e375]  7.48 16.61 0 top
NOREF#74  -  [Pad_e184]  46.75 6.64 0 top
NOREF#75  -  [Pad_e172]  60.53 52.06 0 top
NOREF#76  -  [Pad_e418]  35 0.7 0 top
NOREF#77  -  [Pad_e202]  29.01 4.89 0 top
NOREF#78  -  [Pad_e155]  66.29 28.78 0 top
NOREF#79  -  [Pad_e480]  67.54 44.87 106.9 top
NOREF#80  -  [Pad_e405]  35 69.3 0 top
NOREF#81  -  [Pad_e383]  47.67 65.58 0 top
NOREF#82  -  [Pad_e208]  65.11 29.01 0 top
NOREF#83  -  [Pad_e150]  47.21 5.53 0 top
NOREF#84  -  [Pad_e384]  4.42 22.33 0 top
NOREF#85  -  [Pad_e373]  35 68.1 0 top
NOREF#86  -  [Pad_e359]  4.42 47.67 0 top
NOREF#87  -  [Pad_e379]  58.41 58.41 0 top
NOREF#88  -  [Pad_e190]  13.29 56.71 0 top
NOREF#89  -  [Pad_e412]  54.06 63.52 0 top
NOREF#90  -  [Pad_e377]  1.9 35 0 top
NOREF#91  -  [Pad_e164]  35 4.3 0 top
NOREF#92  -  [Pad_e355]  67.46 28.54 0 top
NOREF#93  -  [Pad_e417]  41.69 1.36 0 top
NOREF#94  -  [Pad_e170]  52.06 9.47 0 top
NOREF#95  -  [Pad_e374]  28.54 2.54 0 top
NOREF#96  -  [Pad_e177]  6.64 23.25 0 top
NOREF#97  -  [Pad_e397]  6.48 54.06 0 top
NOREF#98  -  [Pad_e163]  4.3 35 0 top

## Footprints (pads in the part's own frame, mm; a bottom-side part is the same pattern mirrored in y, then rotated)
Pad_e119
  round 1 hole 0.5: 35(0,0)
Pad_e120
  round 1 hole 0.5: 36(0,0)
Pad_e127
  round 1 hole 0.5: 39(0,0)
Pad_e129
  round 1 hole 0.5: 40(0,0)
Pad_e133
  round 1 hole 0.5: 43(0,0)
Pad_e135
  round 1 hole 0.5: 44(0,0)
Pad_e138
  round 1 hole 0.5: 47(0,0)
Pad_e139
  round 1 hole 0.5: 48(0,0)
Pad_e142
  round 1 hole 0.5: 51(0,0)
Pad_e143
  round 1 hole 0.5: 52(0,0)
Pad_e146
  round 1 hole 0.5: 55(0,0)
Pad_e147
  round 1 hole 0.5: 56(0,0)
Pad_e150
  round 1 hole 0.5: 59(0,0)
Pad_e155
  round 1 hole 0.5: 64(0,0)
Pad_e163
  round 1 hole 0.5: 50(0,0)
Pad_e164
  round 1 hole 0.5: 58(0,0)
Pad_e165
  round 1 hole 0.5: 49(0,0)
Pad_e166
  round 1 hole 0.5: 51(0,0)
Pad_e167
  round 1 hole 0.5: 34(0,0)
Pad_e168
  round 1 hole 0.5: 35(0,0)
Pad_e169
  round 1 hole 0.5: 63(0,0)
Pad_e170
  round 1 hole 0.5: 61(0,0)
Pad_e171
  round 1 hole 0.5: 36(0,0)
Pad_e172
  round 1 hole 0.5: 37(0,0)
Pad_e173
  round 1 hole 0.5: 38(0,0)
Pad_e174
  round 1 hole 0.5: 39(0,0)
Pad_e175
  round 1 hole 0.5: 40(0,0)
Pad_e176
  round 1 hole 0.5: 48(0,0)
Pad_e177
  round 1 hole 0.5: 52(0,0)
Pad_e180
  round 1 hole 0.5: 53(0,0)
Pad_e181
  round 1 hole 0.5: 54(0,0)
Pad_e182
  round 1 hole 0.5: 56(0,0)
Pad_e184
  round 1 hole 0.5: 60(0,0)
Pad_e185
  round 1 hole 0.5: 44(0,0)
Pad_e188
  round 1 hole 0.5: 45(0,0)
Pad_e190
  round 1 hole 0.5: 46(0,0)
Pad_e191
  round 1 hole 0.5: 47(0,0)
Pad_e194
  round 1 hole 0.5: 55(0,0)
Pad_e199
  round 1 hole 0.5: 62(0,0)
Pad_e201
  round 1 hole 0.5: 64(0,0)
Pad_e202
  round 1 hole 0.5: 57(0,0)
Pad_e205
  round 1 hole 0.5: 41(0,0)
Pad_e207
  round 1 hole 0.5: 59(0,0)
Pad_e208
  round 1 hole 0.5: 65(0,0)
Pad_e211
  round 1 hole 0.5: 42(0,0)
Pad_e213
  round 1 hole 0.5: 43(0,0)
Pad_e355
  round 1 hole 0.5: 65(0,0)
Pad_e356
  round 1 hole 0.5: 45(0,0)
Pad_e357
  round 1 hole 0.5: 63(0,0)
Pad_e358
  round 1 hole 0.5: 64(0,0)
Pad_e359
  round 1 hole 0.5: 48(0,0)
Pad_e360
  round 1 hole 0.5: 36(0,0)
Pad_e361
  round 1 hole 0.5: 44(0,0)
Pad_e362
  round 1 hole 0.5: 34(0,0)
Pad_e363
  round 1 hole 0.5: 37(0,0)
Pad_e364
  round 1 hole 0.5: 46(0,0)
Pad_e365
  round 1 hole 0.5: 47(0,0)
Pad_e366
  round 1 hole 0.5: 61(0,0)
Pad_e367
  round 1 hole 0.5: 62(0,0)
Pad_e368
  round 1 hole 0.5: 60(0,0)
Pad_e369
  round 1 hole 0.5: 35(0,0)
Pad_e370
  round 1 hole 0.5: 49(0,0)
Pad_e371
  round 1 hole 0.5: 43(0,0)
Pad_e372
  round 1 hole 0.5: 41(0,0)
Pad_e373
  round 1 hole 0.5: 42(0,0)
Pad_e374
  round 1 hole 0.5: 57(0,0)
Pad_e375
  round 1 hole 0.5: 53(0,0)
Pad_e376
  round 1 hole 0.5: 55(0,0)
Pad_e377
  round 1 hole 0.5: 50(0,0)
Pad_e378
  round 1 hole 0.5: 51(0,0)
Pad_e379
  round 1 hole 0.5: 38(0,0)
Pad_e380
  round 1 hole 0.5: 39(0,0)
Pad_e381
  round 1 hole 0.5: 54(0,0)
Pad_e382
  round 1 hole 0.5: 56(0,0)
Pad_e383
  round 1 hole 0.5: 40(0,0)
Pad_e384
  round 1 hole 0.5: 52(0,0)
Pad_e385
  round 1 hole 0.5: 59(0,0)
Pad_e386
  round 1 hole 0.5: 58(0,0)
Pad_e389
  round 1 hole 0.5: 64(0,0)
Pad_e394
  round 1 hole 0.5: 35(0,0)
Pad_e396
  round 1 hole 0.5: 47(0,0)
Pad_e397
  round 1 hole 0.5: 48(0,0)
Pad_e399
  round 1 hole 0.5: 63(0,0)
Pad_e403
  round 1 hole 0.5: 44(0,0)
Pad_e405
  round 1 hole 0.5: 43(0,0)
Pad_e408
  round 1 hole 0.5: 56(0,0)
Pad_e409
  round 1 hole 0.5: 51(0,0)
Pad_e410
  round 1 hole 0.5: 52(0,0)
Pad_e412
  round 1 hole 0.5: 40(0,0)
Pad_e413
  round 1 hole 0.5: 55(0,0)
Pad_e417
  round 1 hole 0.5: 60(0,0)
Pad_e418
  round 1 hole 0.5: 59(0,0)
Pad_e435
  rect 1x2 smd: 1(0,0)
Pad_e436
  rect 1x2 smd: 2(0,0)
Pad_e473
  rect 1x2 smd: 12(0,0)
Pad_e475
  rect 1x2 smd: 13(0,0)
Pad_e480
  rect 1x2 smd: 15(0,0)
Pad_e481
  rect 1x2 smd: 16(0,0)

## Nets

Pads without a net: NOREF 54; NOREF#2 55; NOREF#3 55; NOREF#4 51; NOREF#5 35; NOREF#6 62; NOREF#7 35; NOREF#8 34; NOREF#9 39; NOREF#10 63; NOREF#11 43; NOREF#12 48; NOREF#13 43; NOREF#14 53; NOREF#15 51; NOREF#16 64; NOREF#17 1; NOREF#18 49; NOREF#19 62; NOREF#20 47; NOREF#21 13; NOREF#22 47; NOREF#23 56; NOREF#24 36; NOREF#25 55; NOREF#26 41; NOREF#27 54; NOREF#28 59; NOREF#29 16; NOREF#30 51; NOREF#31 44; NOREF#32 61; NOREF#33 64; NOREF#34 49; NOREF#35 48; NOREF#36 59; NOREF#37 40; NOREF#38 39; NOREF#39 63; NOREF#40 52; NOREF#41 47; NOREF#42 55; NOREF#43 2; NOREF#44 64; NOREF#45 36; NOREF#46 40; NOREF#47 56; NOREF#48 41; NOREF#49 44; NOREF#50 60; NOREF#51 51; NOREF#52 56; NOREF#53 44; NOREF#54 45; NOREF#55 44; NOREF#56 38; NOREF#57 42; NOREF#58 56; NOREF#59 58; NOREF#60 35; NOREF#61 46; NOREF#62 34; NOREF#63 45; NOREF#64 36; NOREF#65 12; NOREF#66 47; NOREF#67 39; NOREF#68 43; NOREF#69 52; NOREF#70 63; NOREF#71 35; NOREF#72 37; NOREF#73 53; NOREF#74 60; NOREF#75 37; NOREF#76 59; NOREF#77 57; NOREF#78 64; NOREF#79 15; NOREF#80 43; NOREF#81 40; NOREF#82 65; NOREF#83 59; NOREF#84 52; NOREF#85 42; NOREF#86 48; NOREF#87 38; NOREF#88 46; NOREF#89 40; NOREF#90 50; NOREF#91 58; NOREF#92 65; NOREF#93 60; NOREF#94 61; NOREF#95 57; NOREF#96 52; NOREF#97 48; NOREF#98 50

## Routing (per net, layer and track width the routed paths; a pad name or vN(x,y) marks a point on that pad's centre or on a via; arc(x,y) is an arc through that point)
(no net): length 58.1
  Top Layer w0.254: NOREF#32.61 54.63,8.72 NOREF#65.12 ; NOREF#29.16 60.24,56.57 NOREF#87.38 ; NOREF#33.64 64.99,21.74 NOREF#21.13 ; NOREF#43.2 32.92,2.22 NOREF#91.58 ; NOREF#17.1 30.71,3.19 NOREF#77.57 ; NOREF#79.15 67.54,41.53 NOREF#60.35
  Bottom Layer w0.254: NOREF#83.59 47.67,5.07 NOREF#50.60 ; NOREF#41.47 5.07,47.67 NOREF#86.48 ; NOREF#69.52 2.3,28.31 NOREF#51.51 ; NOREF#78.64 67.23,28.78 NOREF#92.65 ; NOREF#35.48 3.48,41.46 NOREF#18.49 ; NOREF#97.48 6.81,54.06 NOREF#66.47 ; NOREF#68.43 28.54,68.41 NOREF#31.44 ; NOREF#45.36 65.12,47.21 NOREF#71.35 ; NOREF#28.59 41.69,2.3 NOREF#93.60 ; NOREF#64.36 61.85,52.72 NOREF#72.37 ; NOREF#89.40 54.06,63.19 NOREF#67.39 ; NOREF#84.52 5.07,22.33 NOREF#30.51 ; NOREF#70.63 NOREF#6.62 ; NOREF#58.56 22.79,4.88 NOREF#2.55 ; NOREF#95.57 28.78,2.77 NOREF#52.56 ; NOREF#40.52 7.81,16.61 NOREF#73.53 ; NOREF#80.43 NOREF#85.42 ; NOREF#55.44 17.28,61.86 NOREF#63.45 ; NOREF#37.40 41.46,66.52 NOREF#48.41 ; NOREF#16.64 62.85,16.61 NOREF#39.63 ; NOREF#20.47 NOREF#61.46 ; NOREF#53.44 22.79,65.12 NOREF#13.43 ; NOREF#90.50 NOREF#15.51 ; NOREF#3.55 NOREF.54 ; NOREF#81.40 47.67,64.93 NOREF#9.39 ; NOREF#8.34 NOREF#5.35 ; NOREF#47.56 16.61,7.15 NOREF#25.55 ; NOREF#59.58 NOREF#76.59
